# EAGLE design InkTimeSlay (EAGLE 9.7.0)
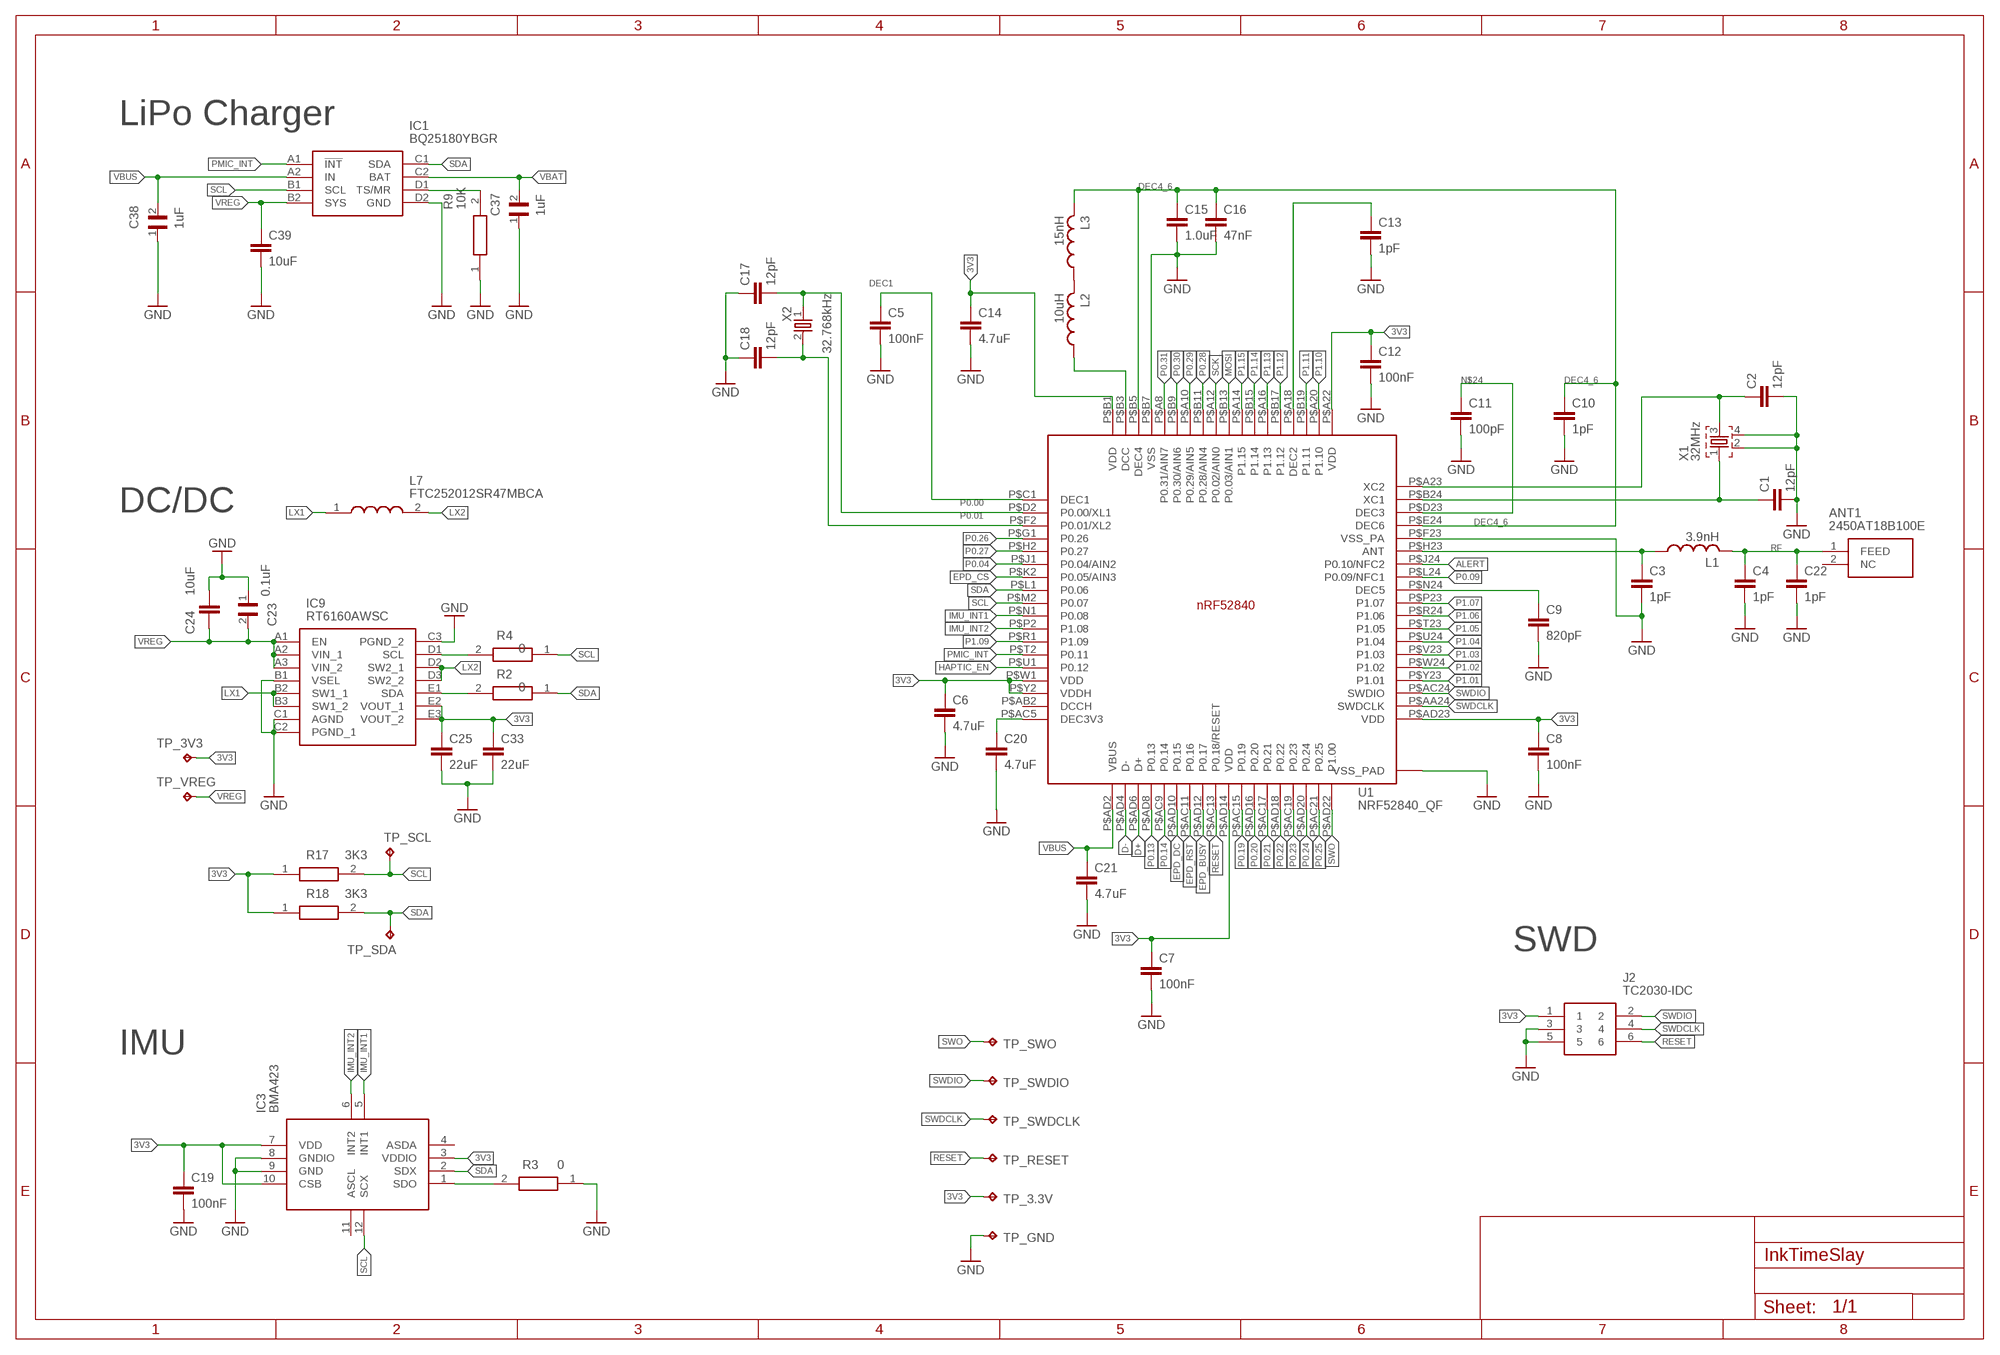
[diagram p0: schematic, sheet 1, part 1 of 2]
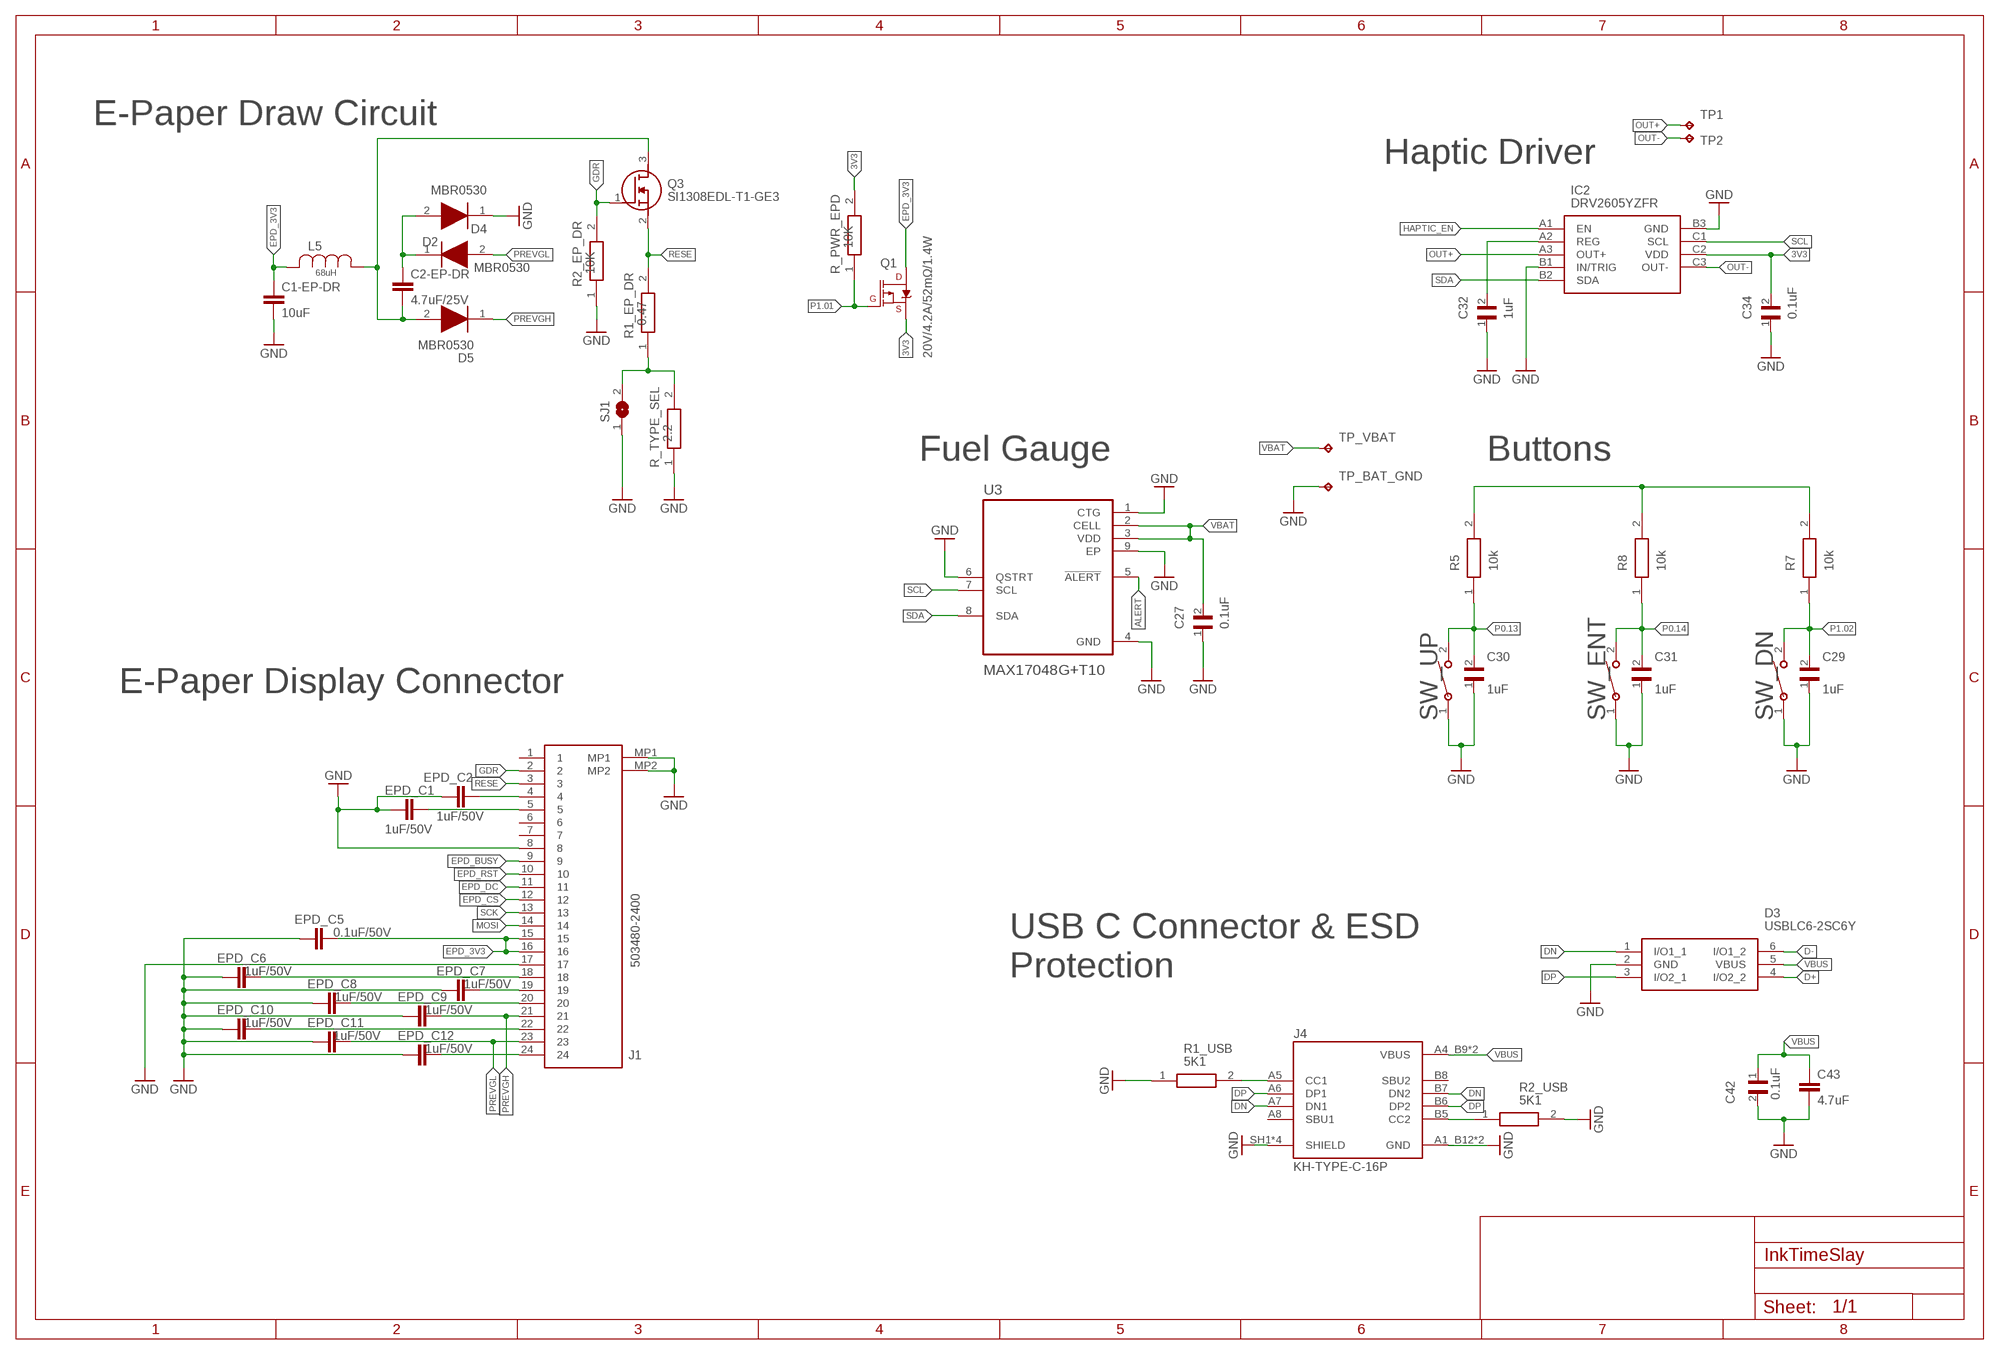
[diagram p1: schematic, sheet 1, part 2 of 2]

## Parts
ANT1  2450AT18B100E  2450AT18B100E_2450AT18B100E  [2450AT18B100E_ANTC3216X140N]
C1  12pF  NORDIC_NRF_3_CAPACITOR_0201_L  [NORDIC_NRF_3_RESC0201_L]
C1-EP-DR  10uF  NORDIC_NRF_3_CAPACITOR_0402_L  [NORDIC_NRF_3_RESC0402_L]
C2  12pF  NORDIC_NRF_3_CAPACITOR_0201_L  [NORDIC_NRF_3_RESC0201_L]
C2-EP-DR  4.7uF/25V  NORDIC_NRF_3_CAPACITOR_0402_L  [NORDIC_NRF_3_RESC0402_L]
C3  1pF  NORDIC_NRF_3_CAPACITOR_0201_L  [NORDIC_NRF_3_RESC0201_L]
C4  1pF  NORDIC_NRF_3_CAPACITOR_0201_L  [NORDIC_NRF_3_RESC0201_L]
C5  100nF  NORDIC_NRF_3_CAPACITOR_0201_L  [NORDIC_NRF_3_RESC0201_L]
C6  4.7uF  NORDIC_NRF_3_CAPACITOR_0402_L  [NORDIC_NRF_3_RESC0402_L]
C7  100nF  NORDIC_NRF_3_CAPACITOR_0201_L  [NORDIC_NRF_3_RESC0201_L]
C8  100nF  NORDIC_NRF_3_CAPACITOR_0201_L  [NORDIC_NRF_3_RESC0201_L]
C9  820pF  NORDIC_NRF_3_CAPACITOR_0201_L  [NORDIC_NRF_3_RESC0201_L]
C10  1pF  NORDIC_NRF_3_CAPACITOR_0201_L  [NORDIC_NRF_3_RESC0201_L]
C11  100pF  NORDIC_NRF_3_CAPACITOR_0201_L  [NORDIC_NRF_3_RESC0201_L]
C12  100nF  NORDIC_NRF_3_CAPACITOR_0201_L  [NORDIC_NRF_3_RESC0201_L]
C13  1pF  NORDIC_NRF_3_CAPACITOR_0201_L  [NORDIC_NRF_3_RESC0201_L]
C14  4.7uF  NORDIC_NRF_3_CAPACITOR_0402_L  [NORDIC_NRF_3_RESC0402_L]
C15  1.0uF  NORDIC_NRF_3_CAPACITOR_0402_L  [NORDIC_NRF_3_RESC0402_L]
C16  47nF  NORDIC_NRF_3_CAPACITOR_0201_L  [NORDIC_NRF_3_RESC0201_L]
C17  12pF  NORDIC_NRF_3_CAPACITOR_0201_L  [NORDIC_NRF_3_RESC0201_L]
C18  12pF  NORDIC_NRF_3_CAPACITOR_0201_L  [NORDIC_NRF_3_RESC0201_L]
C19  100nF  NORDIC_NRF_3_CAPACITOR_0201_L  [NORDIC_NRF_3_RESC0201_L]
C20  4.7uF  NORDIC_NRF_3_CAPACITOR_0402_L  [NORDIC_NRF_3_RESC0402_L]
C21  4.7uF  NORDIC_NRF_3_CAPACITOR_0402_L  [NORDIC_NRF_3_RESC0402_L]
C22  1pF  NORDIC_NRF_3_CAPACITOR_0201_L  [NORDIC_NRF_3_RESC0201_L]
C23  0.1uF  GRM011R60J152KE01L_2_GRM011R60J152KE01L  [GRM011R60J152KE01L_2_CAPC0201X13N]
C24  10uF  NORDIC_NRF_3_CAPACITOR_0402_L  [NORDIC_NRF_3_RESC0402_L]
C25  22uF  NORDIC_NRF_3_CAPACITOR_0402_L  [NORDIC_NRF_3_RESC0402_L]
C27  0.1uF  GRM011R60J152KE01L_2_GRM011R60J152KE01L  [GRM011R60J152KE01L_2_CAPC0201X13N]
C29  1uF  GRM011R60J152KE01L_2_GRM011R60J152KE01L  [GRM011R60J152KE01L_2_CAPC0201X13N]
C30  1uF  GRM011R60J152KE01L_2_GRM011R60J152KE01L  [GRM011R60J152KE01L_2_CAPC0201X13N]
C31  1uF  GRM011R60J152KE01L_2_GRM011R60J152KE01L  [GRM011R60J152KE01L_2_CAPC0201X13N]
C32  1uF  GRM011R60J152KE01L_2_GRM011R60J152KE01L  [GRM011R60J152KE01L_2_CAPC0201X13N]
C33  22uF  NORDIC_NRF_3_CAPACITOR_0402_L  [NORDIC_NRF_3_RESC0402_L]
C34  0.1uF  GRM011R60J152KE01L_2_GRM011R60J152KE01L  [GRM011R60J152KE01L_2_CAPC0201X13N]
C37  1uF  GRM011R60J152KE01L_2_GRM011R60J152KE01L  [GRM011R60J152KE01L_2_CAPC0201X13N]
C38  1uF  GRM011R60J152KE01L_2_GRM011R60J152KE01L  [GRM011R60J152KE01L_2_CAPC0201X13N]
C39  10uF  NORDIC_NRF_3_CAPACITOR_0402_L  [NORDIC_NRF_3_RESC0402_L]
C42  0.1uF  GRM011R60J152KE01L_2_GRM011R60J152KE01L  [GRM011R60J152KE01L_2_CAPC0201X13N]
C43  4.7uF  NORDIC_NRF_3_CAPACITOR_0402_L  [NORDIC_NRF_3_RESC0402_L]
D2  MBR0530  ESP32_C6_LIBRARY_5_MBR0530  [ESP32_C6_LIBRARY_5_SOD3716X135N]
D3  USBLC6-2SC6Y  ESP32_C6_LIBRARY_3_USBLC6-2SC6Y  [ESP32_C6_LIBRARY_3_SOT95P280X145-6N]
D4  MBR0530  ESP32_C6_LIBRARY_5_MBR0530  [ESP32_C6_LIBRARY_5_SOD3716X135N]
D5  MBR0530  ESP32_C6_LIBRARY_5_MBR0530  [ESP32_C6_LIBRARY_5_SOD3716X135N]
EPD_C1  1uF/50V  NORDIC_NRF_3_CAPACITOR_0402_L  [NORDIC_NRF_3_RESC0402_L]
EPD_C2  1uF/50V  NORDIC_NRF_3_CAPACITOR_0402_L  [NORDIC_NRF_3_RESC0402_L]
EPD_C5  0.1uF/50V  NORDIC_NRF_3_CAPACITOR_0201_L  [NORDIC_NRF_3_RESC0201_L]
EPD_C6  1uF/50V  NORDIC_NRF_3_CAPACITOR_0402_L  [NORDIC_NRF_3_RESC0402_L]
EPD_C7  1uF/50V  NORDIC_NRF_3_CAPACITOR_0402_L  [NORDIC_NRF_3_RESC0402_L]
EPD_C8  1uF/50V  NORDIC_NRF_3_CAPACITOR_0402_L  [NORDIC_NRF_3_RESC0402_L]
EPD_C9  1uF/50V  NORDIC_NRF_3_CAPACITOR_0402_L  [NORDIC_NRF_3_RESC0402_L]
EPD_C10  1uF/50V  NORDIC_NRF_3_CAPACITOR_0402_L  [NORDIC_NRF_3_RESC0402_L]
EPD_C11  1uF/50V  NORDIC_NRF_3_CAPACITOR_0402_L  [NORDIC_NRF_3_RESC0402_L]
EPD_C12  1uF/50V  NORDIC_NRF_3_CAPACITOR_0402_L  [NORDIC_NRF_3_RESC0402_L]
IC1  BQ25180YBGR  BQ25180YBGR_BQ25180YBGR  [BQ25180YBGR_BGA8C40P2X4_100X155X50]
IC2  DRV2605YZFR  DRV2605YZFR_DRV2605YZFR  [DRV2605YZFR_BGA9C50P3X3_144X144X62]
IC3  BMA423  BMA423_BMA423  [BMA423_BMA423]
IC9  RT6160AWSC  RT6160AWSC_RT6160AWSC  [RT6160AWSC_BGA15C40P3X5_140X230X60]
J1  503480-2400  503480-2400_503480-2400  [503480-2400_5034802400]
J2  TC2030-IDC  TC2030-IDC_TC2030-IDC  [TC2030-IDC_TC2030IDC]
J4  KH-TYPE-C-16P  KH-TYPE-C-16P_KH-TYPE-C-16P  [KH-TYPE-C-16P_KINGHELM_KH-TYPE-C-16P]
L1  3.9nH  NORDIC_NRF_2_INDUCTOR_0402_L  [NORDIC_NRF_2_RESC0402_L]
L2  10uH  NORDIC_NRF_2_INDUCTOR_0402_L  [NORDIC_NRF_2_RESC0402_L]
L3  15nH  NORDIC_NRF_2_INDUCTOR_0402_L  [NORDIC_NRF_2_RESC0402_L]
L5  68uH  ESP32_C6_LIBRARY_2_744043680IND_4828-WE-TPC_WRE  [ESP32_C6_LIBRARY_2_IND_4828-WE-TPC_WRE]
L7  FTC252012SR47MBCA  MLP2016SR47MT0S1_FTC252012SR47MBCA  [MLP2016SR47MT0S1_INDC2016X100N]
Q1  20V/4.2A/52mΩ/1.4W  ESP32_C6_LIBRARY_4_ESP32_WROVER_SPARKFUN-DISCRETESEMI_MOSFET_PCH-DMG2305UX-7  [ESP32_C6_LIBRARY_4_ESP32_C6_LIBRARY_4_ESP32_C6_LIBRARY_4_ESP32_C6_LIBRARY_4_ESP32_WROVER_SPARKFUN-DISCRETESEMI_SOT23-3]
Q3  SI1308EDL-T1-GE3  ESP32_C6_LIBRARY_6_SI1308EDL-T1-GE3  [ESP32_C6_LIBRARY_6_SOT65P210X110-3N]
R1_EP_DR  0.47  ERA-1AEB3401C_CPF0201D7K68C1  [ERA-1AEB3401C_0201]
R1_USB  5K1  ERA-1AEB3401C_CPF0201D7K68C1  [ERA-1AEB3401C_0201]
R2  0  ERA-1AEB3401C_CPF0201D7K68C1  [ERA-1AEB3401C_0201]
R2_EP_DR  10K  ERA-1AEB3401C_CPF0201D7K68C1  [ERA-1AEB3401C_0201]
R2_USB  5K1  ERA-1AEB3401C_CPF0201D7K68C1  [ERA-1AEB3401C_0201]
R3  0  ERA-1AEB3401C_CPF0201D7K68C1  [ERA-1AEB3401C_0201]
R4  0  ERA-1AEB3401C_CPF0201D7K68C1  [ERA-1AEB3401C_0201]
R5  10k  ERA-1AEB3401C_CPF0201D7K68C1  [ERA-1AEB3401C_0201]
R7  10k  ERA-1AEB3401C_CPF0201D7K68C1  [ERA-1AEB3401C_0201]
R8  10k  ERA-1AEB3401C_CPF0201D7K68C1  [ERA-1AEB3401C_0201]
R9  10K  ERA-1AEB3401C_CPF0201D7K68C1  [ERA-1AEB3401C_0201]
R17  3K3  ERA-1AEB3401C_CPF0201D7K68C1  [ERA-1AEB3401C_0201]
R18  3K3  ERA-1AEB3401C_CPF0201D7K68C1  [ERA-1AEB3401C_0201]
R_PWR_EPD  10K  ERA-1AEB3401C_CPF0201D7K68C1  [ERA-1AEB3401C_0201]
R_TYPE_SEL  2.2  ERA-1AEB3401C_CPF0201D7K68C1  [ERA-1AEB3401C_0201]
SJ1  ESP32_C6_LIBRARY_7_JUMPER_SJ  [ESP32_C6_LIBRARY_7_JUMPER_SJ]
SW_DN  2025-10-22_07-23-44_LIBRARY_EVP-AKE31ASW_EVP-AKE31A_PAN  [2025-10-22_07-23-44_LIBRARY_SW_EVP-AKE31A_PAN]
SW_ENT  2025-10-22_07-23-44_LIBRARY_EVP-AKE31ASW_EVP-AKE31A_PAN  [2025-10-22_07-23-44_LIBRARY_SW_EVP-AKE31A_PAN]
SW_UP  2025-10-22_07-23-44_LIBRARY_EVP-AKE31ASW_EVP-AKE31A_PAN  [2025-10-22_07-23-44_LIBRARY_SW_EVP-AKE31A_PAN]
TP1  HECTOR_WATCH_1_TPTP20R  [HECTOR_WATCH_1_TP20R]
TP2  HECTOR_WATCH_1_TPTP20R  [HECTOR_WATCH_1_TP20R]
TP_3.3V  HECTOR_WATCH_1_TPTP20R  [HECTOR_WATCH_1_TP20R]
TP_3V3  HECTOR_WATCH_1_TPTP20R  [HECTOR_WATCH_1_TP20R]
TP_BAT_GND  HECTOR_WATCH_1_TPTP20R  [HECTOR_WATCH_1_TP20R]
TP_GND  HECTOR_WATCH_1_TPTP20R  [HECTOR_WATCH_1_TP20R]
TP_RESET  HECTOR_WATCH_1_TPTP20R  [HECTOR_WATCH_1_TP20R]
TP_SCL  HECTOR_WATCH_1_TPTP20R  [HECTOR_WATCH_1_TP20R]
TP_SDA  HECTOR_WATCH_1_TPTP20R  [HECTOR_WATCH_1_TP20R]
TP_SWDCLK  HECTOR_WATCH_1_TPTP20R  [HECTOR_WATCH_1_TP20R]
TP_SWDIO  HECTOR_WATCH_1_TPTP20R  [HECTOR_WATCH_1_TP20R]
TP_SWO  HECTOR_WATCH_1_TPTP20R  [HECTOR_WATCH_1_TP20R]
TP_VBAT  HECTOR_WATCH_1_TPTP20R  [HECTOR_WATCH_1_TP20R]
TP_VREG  HECTOR_WATCH_1_TPTP20R  [HECTOR_WATCH_1_TP20R]
U1  NRF52840_QF  NORDIC_NRF_4_NRF52840_QF  [NORDIC_NRF_4_AQFN50P700X700X85_HS-74N]
U3  MAX17048G+T10  ESP32_C6_LIBRARY_MAX17048G+T10  [ESP32_C6_LIBRARY_SON50P200X200X80-9N]
X1  32MHz  NORDIC_NRF_XTAL_32MHZ  [NORDIC_NRF_BT-XTAL_2016_N]
X2  32.768kHz  NORDIC_NRF_1_XTAL_32KHZ  [NORDIC_NRF_1_XTAL_3215_N]

## Nets
3V3: C6.1 C7.1 C8.1 C12.1 C14.1 C19.1 C25.1 C33.1 C34.2 IC2.C2(VDD) IC3.3(VDDIO) IC3.7(VDD) IC3.10(CSB) IC9.E2(VOUT_1) IC9.E3(VOUT_2) J2.1 Q1.2(S) R17.1 R18.1 R_PWR_EPD.2 TP_3.3V.TP TP_3V3.TP U1.P$A22(VDD) U1.P$AD14(VDD) U1.P$AD23(VDD) U1.P$B1(VDD) U1.P$W1(VDD) U1.P$Y2(VDDH)
ALERT: U1.P$J24(P0.10/NFC2) U3.5(!ALERT)
D+: D3.4(I/O2_2) U1.P$AD6(D+)
D-: D3.6(I/O1_2) U1.P$AD4(D-)
DEC1: C5.1 U1.P$C1(DEC1)
DEC4_6: C10.1 C15.1 C16.1 L3.2 U1.P$B5(DEC4) U1.P$E24(DEC6)
DN: D3.1(I/O1_1) J4.A7(DN1) J4.B7(DN2)
DP: D3.3(I/O2_1) J4.A6(DP1) J4.B6(DP2)
EPD_3V3: C1-EP-DR.1 EPD_C5.2 J1.15 J1.16 L5.2 Q1.3(D)
EPD_BUSY: J1.9 U1.P$AD12(P0.17)
EPD_CS: J1.12 U1.P$K2(P0.05/AIN3)
EPD_DC: J1.11 U1.P$AD10(P0.15)
EPD_RST: J1.10 U1.P$AC11(P0.16)
GDR: J1.2 Q3.1(G) R2_EP_DR.2
GND: C1-EP-DR.2 C1.2 C2.2 C3.2 C4.2 C5.2 C6.2 C7.2 C8.2 C9.2 C10.2 C11.2 C12.2 C13.2 C14.2 C15.2 C16.2 C17.1 C18.1 C19.2 C20.2 C21.2 C22.2 C23.1 C24.1 C25.2 C27.1 C29.1 C30.1 C31.1 C32.1 C33.2 C34.1 C37.1 C38.1 C39.2 C42.2 C43.2 D3.2(GND) D4.1(K) EPD_C1.1 EPD_C2.1 EPD_C5.1 EPD_C6.1 EPD_C7.1 EPD_C8.1 EPD_C9.1 EPD_C10.1 EPD_C11.1 EPD_C12.1 IC1.D2(GND) IC2.B1(IN/TRIG) IC2.B3(GND) IC3.8(GNDIO) IC3.9(GND) IC9.B1(VSEL) IC9.C1(AGND) IC9.C2(PGND_1) IC9.C3(PGND_2) J1.8 J1.17 J1.MP1 J1.MP2 J2.3 J2.5 J4.A1_B12(GND) J4.A12_B1(GND) J4.SH1(SHIELD) J4.SH2(SHIELD) J4.SH3(SHIELD) J4.SH4(SHIELD) R1_USB.1 R2_EP_DR.1 R2_USB.2 R3.1 R9.1 R_TYPE_SEL.1 SJ1.1 SW_DN.1 SW_ENT.1 SW_UP.1 TP_BAT_GND.TP TP_GND.TP U1.P$74(VSS_PAD) U1.P$75(VSS_PAD) U1.P$76(VSS_PAD) U1.P$77(VSS_PAD) U1.P$78(VSS_PAD) U1.P$79(VSS_PAD) U1.P$80(VSS_PAD) U1.P$81(VSS_PAD) U1.P$82(VSS_PAD) U1.P$83(VSS_PAD) U1.P$84(VSS_PAD) U1.P$85(VSS_PAD) U1.P$86(VSS_PAD) U1.P$87(VSS_PAD) U1.P$88(VSS_PAD) U1.P$89(VSS_PAD) U1.P$90(VSS_PAD) U1.P$B7(VSS) U1.P$F23(VSS_PA) U3.1(CTG) U3.4(GND) U3.6(QSTRT) U3.9(EP) X1.2 X1.4
HAPTIC_EN: IC2.A1(EN) U1.P$U1(P0.12)
IMU_INT1: IC3.5(INT1) U1.P$N1(P0.08)
IMU_INT2: IC3.6(INT2) U1.P$P2(P1.08)
LX1: IC9.B2(SW1_1) IC9.B3(SW1_2) L7.1
LX2: IC9.D2(SW2_1) IC9.D3(SW2_2) L7.2
MOSI: J1.14 U1.P$B13(P0.03/AIN1)
N$1: C2-EP-DR.2 D5.2(A) L5.1 Q3.3(D)
N$2: L2.2 L3.1
N$3: IC1.D1(TS/MR) R9.2
N$4: C1.1 U1.P$B24(XC1) X1.1
N$5: L2.1 U1.P$B3(DCC)
N$6: C2-EP-DR.1 D2.1(K) D4.2(A)
N$7: R5.2 R7.2 R8.2
N$8: C32.2 IC2.A2(REG)
N$9: R1_EP_DR.1 R_TYPE_SEL.2 SJ1.2
N$10: J4.A5(CC1) R1_USB.2
N$11: EPD_C2.2 J1.4
N$12: EPD_C1.2 J1.5
N$14: C9.1 U1.P$N24(DEC5)
N$15: C13.1 U1.P$A18(DEC2)
N$17: C20.1 U1.P$AC5(DEC3V3)
N$18: IC9.D1(SCL) R4.2
N$19: J4.B5(CC2) R2_USB.1
N$20: C3.1 L1.1 U1.P$H23(ANT)
N$21: IC9.E1(SDA) R2.2
N$24: C11.1 U1.P$D23(DEC3)
N$25: IC3.1(SDO) R3.2
N$26: EPD_C6.2 J1.18
N$27: EPD_C7.2 J1.19
N$28: C2.1 U1.P$A23(XC2) X1.3
N$29: EPD_C8.2 J1.20
N$31: EPD_C10.2 J1.22
N$33: EPD_C12.2 J1.24
OUT+: IC2.A3(OUT+) TP1.TP
OUT-: IC2.C3(OUT-) TP2.TP
P0.00: C17.2 U1.P$D2(P0.00/XL1) X2.1
P0.01: C18.2 U1.P$F2(P0.01/XL2) X2.2
P0.04: U1.P$J1(P0.04/AIN2)
P0.09: U1.P$L24(P0.09/NFC1)
P0.13: C30.2 R5.1 SW_UP.2 U1.P$AD8(P0.13)
P0.14: C31.2 R8.1 SW_ENT.2 U1.P$AC9(P0.14)
P0.19: U1.P$AC15(P0.19)
P0.20: U1.P$AD16(P0.20)
P0.21: U1.P$AC17(P0.21)
P0.22: U1.P$AD18(P0.22)
P0.23: U1.P$AC19(P0.23)
P0.24: U1.P$AD20(P0.24)
P0.25: U1.P$AC21(P0.25)
P0.26: U1.P$G1(P0.26)
P0.27: U1.P$H2(P0.27)
P0.28: U1.P$B11(P0.28/AIN4)
P0.29: U1.P$A10(P0.29/AIN5)
P0.30: U1.P$B9(P0.30/AIN6)
P0.31: U1.P$A8(P0.31/AIN7)
P1.01: Q1.1(G) R_PWR_EPD.1 U1.P$Y23(P1.01)
P1.02: C29.2 R7.1 SW_DN.2 U1.P$W24(P1.02)
P1.03: U1.P$V23(P1.03)
P1.04: U1.P$U24(P1.04)
P1.05: U1.P$T23(P1.05)
P1.06: U1.P$R24(P1.06)
P1.07: U1.P$P23(P1.07)
P1.09: U1.P$R1(P1.09)
P1.10: U1.P$A20(P1.10)
P1.11: U1.P$B19(P1.11)
P1.12: U1.P$B17(P1.12)
P1.13: U1.P$A16(P1.13)
P1.14: U1.P$B15(P1.14)
P1.15: U1.P$A14(P1.15)
PMIC_INT: IC1.A1(!INT) U1.P$T2(P0.11)
PREVGH: D5.1(K) EPD_C9.2 J1.21
PREVGL: D2.2(A) EPD_C11.2 J1.23
RESE: J1.3 Q3.2(S) R1_EP_DR.2
RESET: J2.6 TP_RESET.TP U1.P$AC13(P0.18/RESET)
RF: ANT1.1(FEED) C4.1 C22.1 L1.2
SCK: J1.13 U1.P$A12(P0.02/AIN0)
SCL: IC1.B1(SCL) IC2.C1(SCL) IC3.12(SCX) R4.1 R17.2 TP_SCL.TP U1.P$M2(P0.07) U3.7(SCL)
SDA: IC1.C1(SDA) IC2.B2(SDA) IC3.2(SDX) R2.1 R18.2 TP_SDA.TP U1.P$L1(P0.06) U3.8(SDA)
SWDCLK: J2.4 TP_SWDCLK.TP U1.P$AA24(SWDCLK)
SWDIO: J2.2 TP_SWDIO.TP U1.P$AC24(SWDIO)
SWO: TP_SWO.TP U1.P$AD22(P1.00)
VBAT: C27.2 C37.2 IC1.C2(BAT) TP_VBAT.TP U3.2(CELL) U3.3(VDD)
VBUS: C21.1 C38.2 C42.1 C43.1 D3.5(VBUS) IC1.A2(IN) J4.A4_B9(VBUS) J4.A9_B4(VBUS) U1.P$AD2(VBUS)
VREG: C23.2 C24.2 C39.1 IC1.B2(SYS) IC9.A1(EN) IC9.A2(VIN_1) IC9.A3(VIN_2) TP_VREG.TP
Unconnected: ANT1.2(NC) IC3.4(ASDA) IC3.11(ASCL) J1.1 J1.6 J1.7 J4.A8(SBU1) J4.B8(SBU2) U1.P$AB2(DCCH)

## Notes on the sheet
- LiPo Charger
- DC/DC
- SWD
- IMU
- E-Paper Draw Circuit
- Haptic Driver
- Fuel Gauge | Buttons
- E-Paper Display Connector
- USB C Connector & ESD
  Protection

## Library data of the parts
ANT1 = InkTime_v5:2450AT18B100E_2450AT18B100E: Antennas 2.45GHz ANTENNA Source: Datasheet <https://www.johansontechnology.com/datasheets/2450AT18B100/2450AT18B100.pdf>; ARROW_PART_NUMBER: 2450AT18B100E; ARROW_PRICE-STOCK: https://www.arrow.com/en/products/2450at18b100e/johanson-dielectrics?utm_currency=USD&region=nac; DESCRIPTION: Antennas 2.45GHz ANTENNA; HEIGHT: 1.4mm; MANUFACTURER_NAME: JOHANSON TECHNOLOGY; MANUFACTURER_PART_NUMBER: 2450AT18B100E; MOUSER_PART_NUMBER: 609-2450AT18B100E; MOUSER_PRICE-STOCK: https://www.mouser.co.uk/ProductDetail/Johanson-Technology/2450AT18B100E?qs=yCnrNFeXz%252Bh5MFsFIXGZGA%3D%3D
C1 C1-EP-DR C2 C2-EP-DR C3-C22 C24 C25 C33 C39 C43 EPD_C1 EPD_C2 EPD_C5-EPD_C12 = InkTime_v5:NORDIC_NRF_3_CAPACITOR: Generic chip capacitor
C23 C27 C29-C32 C34 C37 C38 C42 = InkTime_v5:GRM011R60J152KE01L_2_GRM011R60J152KE01L: Check availability <https://pricing.snapeda.com/parts/GRM011R60J152KE01L/Murata/view-part?ref=eda>; AVAILABILITY: In Stock; CHECK_PRICES: https://www.snapeda.com/parts/GRM011R60J152KE01L/Murata/view-part/?ref=eda; DESCRIPTION: SMD Capacitor X5R(EIA) with Capacitance: 1500pF Tol. 10%. Rated Voltage: 6.3Vdc; MF: Murata; MP: GRM011R60J152KE01L; PACKAGE: 0201 Murata; PRICE: None; SNAPEDA_LINK: https://www.snapeda.com/parts/GRM011R60J152KE01L/Murata/view-part/?ref=snap
D2 D4 D5 = InkTime_v5:ESP32_C6_LIBRARY_5_MBR0530: ON SEMICONDUCTOR - MBR0530 - DIODE, SCHOTTKY, 0.5A, 30V, SOD-123 Source: Datasheet <http://www.onsemi.com/pub/Collateral/MBR0530T1-D.PDF> Check availability <https://pricing.snapeda.com/parts/MBR0530/ON%20Semiconductor/view-part?ref=eda>; AVAILABILITY: In Stock; CHECK_PRICES: https://www.snapeda.com/parts/MBR0530/Onsemi/view-part/?ref=eda; DESCRIPTION: Diode Schottky 30 V 500mA Surface Mount SOD-123; MF: ON Semiconductor; MP: MBR0530; PACKAGE: SOD-123-2 ON Semiconductor; PRICE: None; PURCHASE-URL: https://www.snapeda.com/api/url_track_click_mouser/?unipart_id=179458&manufacturer=ON Semiconductor&part_name=MBR0530&search_term=None; SNAPEDA_LINK: https://www.snapeda.com/parts/MBR0530/Onsemi/view-part/?ref=snap
D3 = InkTime_v5:ESP32_C6_LIBRARY_3_USBLC6-2SC6Y: Low Cap. ESD Protection Auto SOT-23-6 STMicroelectronics USBLC6-2SC6Y, Dual Uni-Directional TVS Diode Array, 6-Pin SOT-23 Source: Datasheet <https://componentsearchengine.com/Datasheets/1/USBLC6-2SC6Y.pdf> Check availability <https://pricing.snapeda.com/parts/USBLC6-2SC6Y/STMicroelectronics/view-part?ref=eda>; AVAILABILITY: In Stock; CHECK_PRICES: https://www.snapeda.com/parts/USBLC6-2SC6Y/STMicroelectronics/view-part/?ref=eda; DESCRIPTION: 17V Clamp 5A (8/20µs) Ipp Tvs Diode Surface Mount SOT-23-6; MF: STMicroelectronics; MP: USBLC6-2SC6Y; PACKAGE: SOT-23-6 STMicroelectronics; PRICE: None; SNAPEDA_LINK: https://www.snapeda.com/parts/USBLC6-2SC6Y/STMicroelectronics/view-part/?ref=snap
IC1 = InkTime_v5:BQ25180YBGR_BQ25180YBGR: Charger IC Lithium Ion/Polymer, Lithium Iron Phosphate 8-DSBGA (1.6x1.1) Source: Datasheet <https://www.ti.com/lit/ds/symlink/bq25180.pdf?ts=1650264094470&ref_url=https%3A%2F%2Fwww.ti.com%2Fproduct%2FBQ25180>; ARROW_PART_NUMBER: BQ25180YBGR; ARROW_PRICE-STOCK: https://www.arrow.com/en/products/bq25180ybgr/texas-instruments?utm_currency=USD&region=nac; DESCRIPTION: Charger IC Lithium Ion/Polymer, Lithium Iron Phosphate 8-DSBGA (1.6x1.1); HEIGHT: 0.5mm; MANUFACTURER_NAME: Texas Instruments; MANUFACTURER_PART_NUMBER: BQ25180YBGR; MOUSER_PART_NUMBER: 595-BQ25180YBGR; MOUSER_PRICE-STOCK: https://www.mouser.co.uk/ProductDetail/Texas-Instruments/BQ25180YBGR?qs=doiCPypUmgEWjAK%252BJAX6Tw%3D%3D
IC2 = InkTime_v5:DRV2605YZFR_DRV2605YZFR: Haptic Driver for ERM/LRA with Built-In Library and Smart Loop Architecture Source: Datasheet <http://www.ti.com/lit/gpn/drv2605>; ARROW_PART_NUMBER: DRV2605YZFR; ARROW_PRICE-STOCK: https://www.arrow.com/en/products/drv2605yzfr/texas-instruments?region=nac; DESCRIPTION: Haptic Driver for ERM/LRA with Built-In Library and Smart Loop Architecture; HEIGHT: 0.625mm; MANUFACTURER_NAME: Texas Instruments; MANUFACTURER_PART_NUMBER: DRV2605YZFR
IC3 = InkTime_v5:BMA423_BMA423: Accelerometers Triaxial low-g 12bit Acceleration Sensor Source: Datasheet <https://www.mouser.com/datasheet/2/783/BST-BMA423-DS000-1509600.pdf>; ARROW_PART_NUMBER: BMA423; ARROW_PRICE-STOCK: https://www.arrow.com/en/products/bma423/bosch; DESCRIPTION: Accelerometers Triaxial low-g 12bit Acceleration Sensor; HEIGHT: 1mm; MANUFACTURER_NAME: BOSCH; MANUFACTURER_PART_NUMBER: BMA423; MOUSER_PART_NUMBER: 262-BMA423; MOUSER_PRICE-STOCK: https://www.mouser.co.uk/ProductDetail/Bosch-Sensortec/BMA423?qs=HXFqYaX1Q2xC%252BSgeGoX3mg%3D%3D
IC9 = InkTime_v5:RT6160AWSC_RT6160AWSC: Buck-Boost Regulator Positive Output Step-Up/Step-Down I2C DC-DC Controller IC 15-WL-CSP (BSC) (1.4x2.3) Source: Datasheet <https://www.richtek.com/SaveDownload.aspx?specid=RT6160A>; DESCRIPTION: Buck-Boost Regulator Positive Output Step-Up/Step-Down I2C DC-DC Controller IC 15-WL-CSP (BSC) (1.4x2.3); HEIGHT: 0.6mm; MANUFACTURER_NAME: RICHTEK; MANUFACTURER_PART_NUMBER: RT6160AWSC; MOUSER_PART_NUMBER: 835-RT6160AWSC; MOUSER_PRICE-STOCK: https://www.mouser.co.uk/ProductDetail/Richtek/RT6160AWSC?qs=amGC7iS6iy%2FLd9PSoixZXQ%3D%3D
J1 = InkTime_v5:503480-2400_503480-2400: FFC & FPC Connectors 0.5mm FPC RA SMT Dual Contact 24Ckt Source: Datasheet <https://componentsearchengine.com/Datasheets/1/503480-2400.pdf>; DESCRIPTION: FFC & FPC Connectors 0.5mm FPC RA SMT Dual Contact 24Ckt; HEIGHT: 1.87mm; MANUFACTURER_NAME: Molex; MANUFACTURER_PART_NUMBER: 503480-2400; MOUSER_PART_NUMBER: 538-503480-2400; MOUSER_PRICE-STOCK: https://www.mouser.co.uk/ProductDetail/Molex/503480-2400?qs=OAhjpuo3Vu7efIoxFh9AOw%3D%3D
J2 = InkTime_v5:TC2030-IDC_TC2030-IDC: CABLE ADAPTER 6 POS Source: Datasheet <https://datasheet.datasheetarchive.com/originals/distributors/Datasheets_SAMA/62bc384e093448baaaa63dbd0b9d8707.pdf>; DESCRIPTION: CABLE ADAPTER 6 POS; HEIGHT: 19mm; MANUFACTURER_NAME: Tag Connect; MANUFACTURER_PART_NUMBER: TC2030-IDC
J4 = InkTime_v5:KH-TYPE-C-16P_KH-TYPE-C-16P: Check availability <https://pricing.snapeda.com/parts/KH-TYPE-C-16P/kinghelm/view-part?ref=eda>; AVAILABILITY: Not in stock; CHECK_PRICES: https://www.snapeda.com/parts/KH-TYPE-C-16P/Kinghelm/view-part/?ref=eda; MF: kinghelm; MP: KH-TYPE-C-16P; PACKAGE: None; PRICE: None; SNAPEDA_LINK: https://www.snapeda.com/parts/KH-TYPE-C-16P/Kinghelm/view-part/?ref=snap
L1-L3 = InkTime_v5:NORDIC_NRF_2_INDUCTOR: Generic chip inductor
L5 = InkTime_v5:ESP32_C6_LIBRARY_2_744043680; COPYRIGHT: Copyright (C) 2024 Ultra Librarian. All rights reserved.; MANUFACTURER_PART_NUMBER: 744043680; MFR_NAME: Wurth Electronics
L7 = InkTime_v5:MLP2016SR47MT0S1_FTC252012SR47MBCA: SMD / SMT Inductors (Coils), L=0.47?H, L x W x T : Source: Datasheet <https://product.tdk.com/system/files/dam/doc/product/inductor/inductor/smd/catalog/inductor_commercial_power_mlp2016_en.pdf>; DESCRIPTION: SMD / SMT Inductors (Coils), L=0.47?H, L x W x T :; HEIGHT: 1mm; JLCPCB: https://jlcpcb.com/partdetail/6763488-FTC252012SR47MBCA/C5832368; MANUFACTURER_NAME: TDK; MANUFACTURER_PART_NUMBER: FTC252012SR47MBCA
Q1 = InkTime_v5:ESP32_C6_LIBRARY_4_ESP32_WROVER_SPARKFUN-DISCRETESEMI_MOSFET_PCH: P-channel MOSFETs Voltage controlled devices that allow control of high current outputs. SparkFun Products: SparkFun ESP32 Thing <https://www.sparkfun.com/products/13907> SparkFun ESP8266 Thing <https://www.sparkfun.com/products/13231> SparkFun Pi Servo HAT V2 <https://www.sparkfun.com/products/15316> DMG2305UX-7 (20V/4.2A/SOT23-3); PROD_ID: TRAN-14388
Q3 = InkTime_v5:ESP32_C6_LIBRARY_6_SI1308EDL-T1-GE3: MOSFET N-Ch 30V 1.5A TrenchFET SC70 Vishay Si1308EDL-T1-GE3 N-channel MOSFET Transistor, 1.5 A, 30 V, 3-Pin SC-70 Source: Datasheet <https://componentsearchengine.com/Datasheets/1/SI1308EDL-T1-GE3.pdf> Check availability <https://pricing.snapeda.com/parts/SI1308EDL-T1-GE3/Vishay%20Siliconix/view-part?ref=eda>; AVAILABILITY: In Stock; CHECK_PRICES: https://www.snapeda.com/parts/SI1308EDL-T1-GE3/Vishay+Siliconix/view-part/?ref=eda; DESCRIPTION: Si1308EDL-T1-GE3 N-channel MOSFET Transistor, 1.5 A, 30 V, 3-Pin SC-70 | Siliconix / Vishay SI1308EDL-T1-GE3; MF: Vishay Siliconix; MP: SI1308EDL-T1-GE3; PACKAGE: SOT-323 Vishay Semiconductor; PRICE: None; PURCHASE-URL: https://www.snapeda.com/api/url_track_click_mouser/?unipart_id=274603&manufacturer=Vishay Siliconix&part_name=SI1308EDL-T1-GE3&search_term=None; SNAPEDA_LINK: https://www.snapeda.com/parts/SI1308EDL-T1-GE3/Vishay+Siliconix/view-part/?ref=snap
R1_EP_DR R1_USB R2 R2_EP_DR R2_USB R3-R5 R7-R9 R17 R18 R_PWR_EPD R_TYPE_SEL = InkTime_v5:ERA-1AEB3401C_CPF0201D7K68C1: 7.68k 0201 Thin Film Surface Mount Fixed Resistor +/-0.5% 0.031W CPF0201D7K68C1 Source: Datasheet <http://www.te.com/commerce/DocumentDelivery/DDEController?Action=showdoc&DocId=Data Sheet1773200-1ApdfEnglishENG_DS_1773200-1_A.pdf4-2176215-6>
SJ1 = InkTime_v5:ESP32_C6_LIBRARY_7_JUMPER_SJ: SMD solder JUMPER
SW_DN SW_ENT SW_UP = InkTime_v5:2025-10-22_07-23-44_LIBRARY_EVP-AKE31A; COPYRIGHT: Copyright (C) 2025 Ultra Librarian. All rights reserved.; DIGI-KEY_PART_NUMBER_1: P123437TR-ND; DIGI-KEY_PART_NUMBER_2: P123437CT-ND; DIGI-KEY_PART_NUMBER_3: P123437DKR-ND; MANUFACTURER_NAME: Panasonic; MANUFACTURER_PART_NUMBER: EVP-AKE31A
TP1 TP2 TP_3.3V TP_3V3 TP_BAT_GND TP_GND TP_RESET TP_SCL TP_SDA TP_SWDCLK TP_SWDIO TP_SWO TP_VBAT TP_VREG = InkTime_v5:HECTOR_WATCH_1_TP: Test pad
U1 = InkTime_v5:NORDIC_NRF_4_NRF52840_QF: nRF52840 Features Advanced Single chip 2.4 GHz multi-protocol SoC 32-bit ARM Cortex-M4F Processor 1.7v to 5.5v operation 1MB flash + 256kB RAM Bluetooth 5 support for long range and high throughput 802.15.4 radio support On-chip NFC PPI –Programmable Peripheral Interconnect Automated power management system with automatic power management of each peripheral Configurable I/O mapping for analog and digital I/O 48 x GPIO 1 x QSPI 4 x Master/Slave SPI 2 x Two-wire interface (I²C) I²S interface 2 x UART 4 x PWM USB 2.0 controller ARM TrustZone CryptoCell-310 Cryptographic and security module AES 128-bit ECB/CCM/AAR hardware accelerator Digital microphone interface (PDM) Quadrature decoder 12-bit ADC Low power comparator On-chip 50Ω balun On-air compatible with nRF52, nRF51 and nRF24 Series Applications Advanced high performance wearables Wearables for secure payments Virtual Reality/Augmented Reality systems Smart Home sensor networks Smart city sensor networks High performance HID controllers Internet of Things (IoT) sensor networks Smart door locks Smart lighting networks Connected white goods
U3 = InkTime_v5:ESP32_C6_LIBRARY_MAX17048G+T10: Check availability <https://pricing.snapeda.com/parts/MAX17048G%2BT10/Analog%20Devices/view-part?ref=eda>; AVAILABILITY: In Stock; CHECK_PRICES: https://www.snapeda.com/parts/MAX17048G+T10/Analog+Devices/view-part/?ref=eda; DESCRIPTION: 3µA 1-Cell/2-Cell Fuel Gauge with ModelGauge; MF: Analog Devices; MP: MAX17048G+T10; PACKAGE: TDFN-8 Maxim; PRICE: None; PURCHASE-URL: https://www.snapeda.com/api/url_track_click_mouser/?unipart_id=329239&manufacturer=Analog Devices&part_name=MAX17048G+T10&search_term=None; SNAPEDA_LINK: https://www.snapeda.com/parts/MAX17048G+T10/Analog+Devices/view-part/?ref=snap
X1 = InkTime_v5:NORDIC_NRF_XTAL_32MHZ
X2 = InkTime_v5:NORDIC_NRF_1_XTAL_32KHZ

## Board
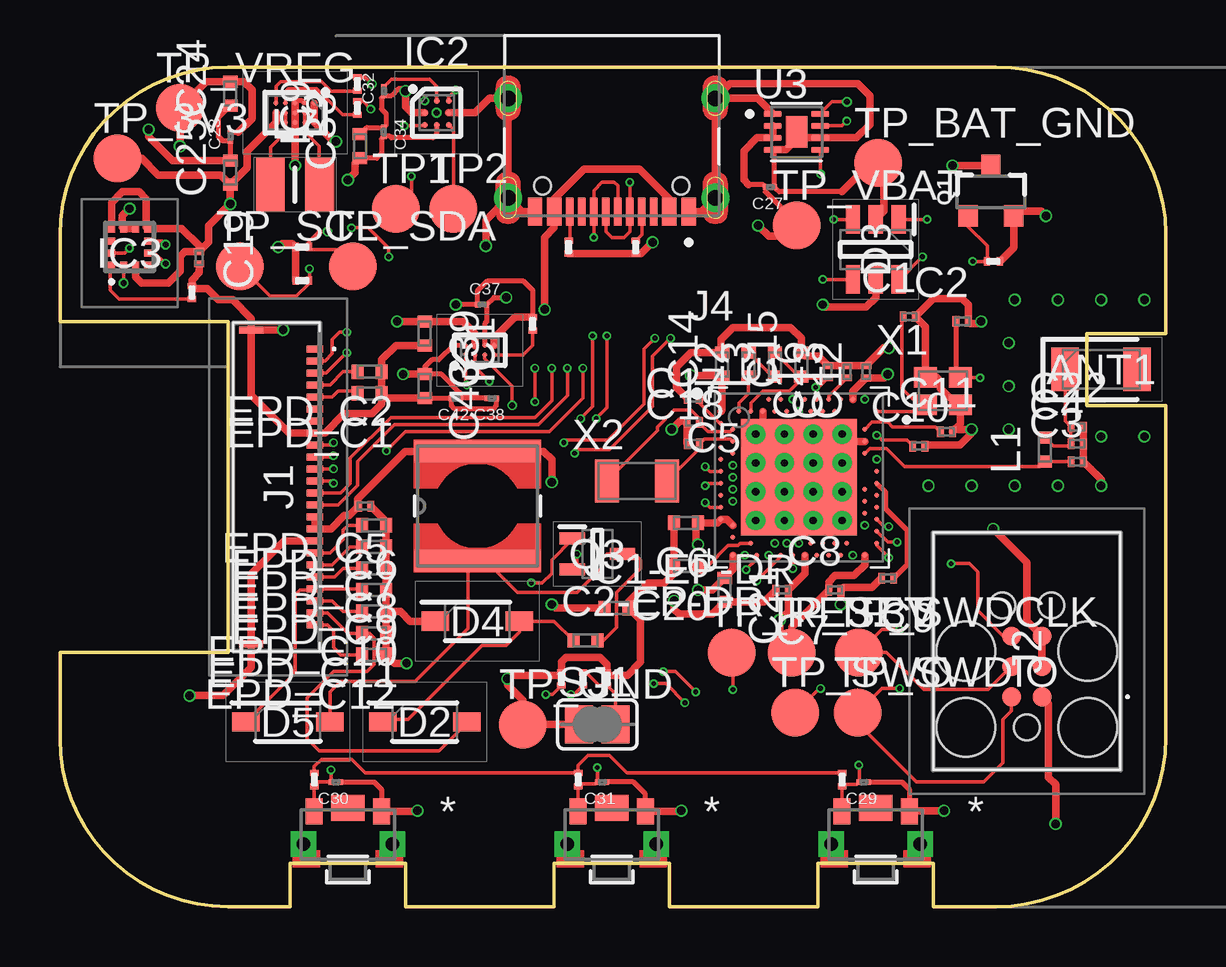
[diagram p2: board, top side]
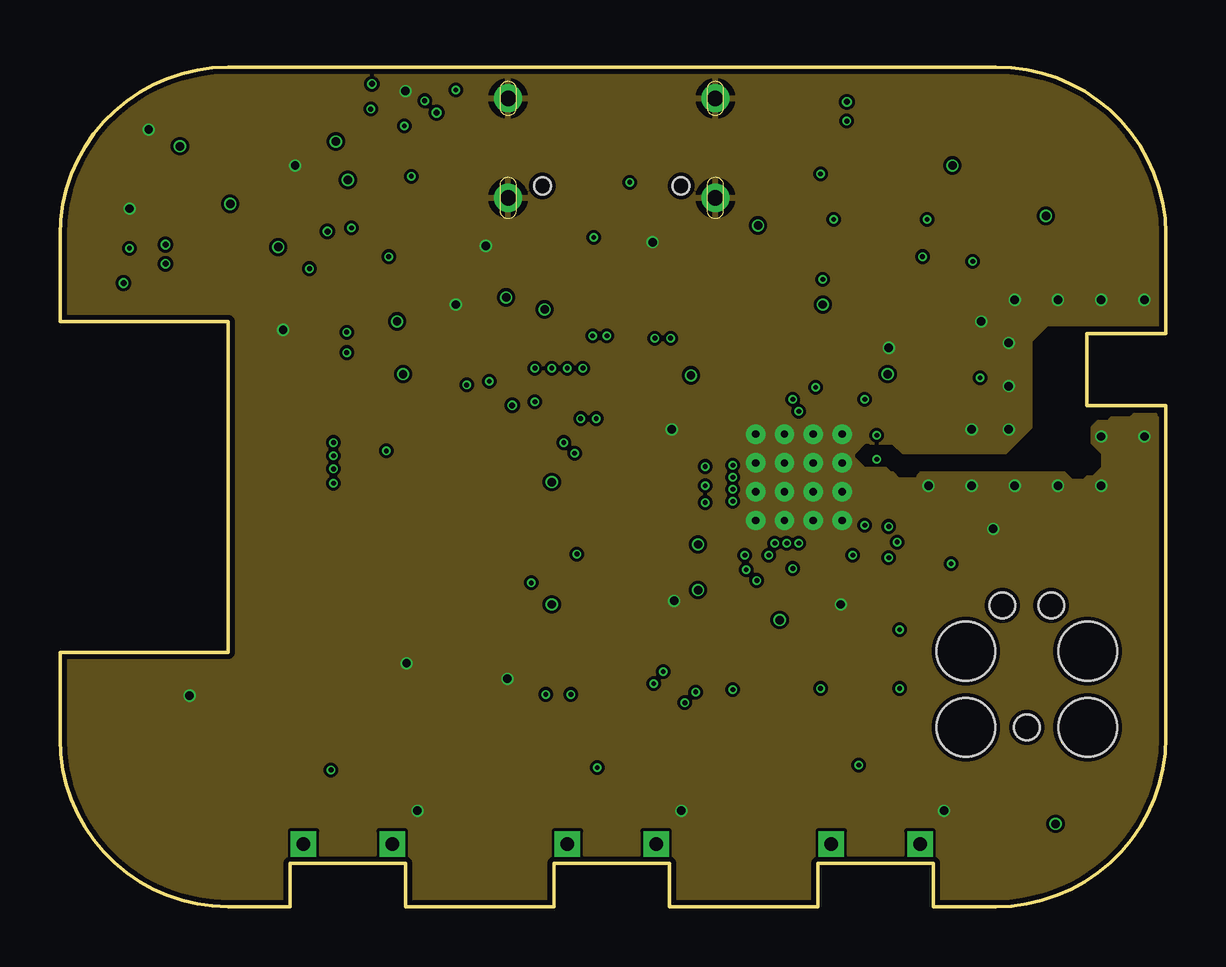
[diagram p3: board, inner layer Route2]
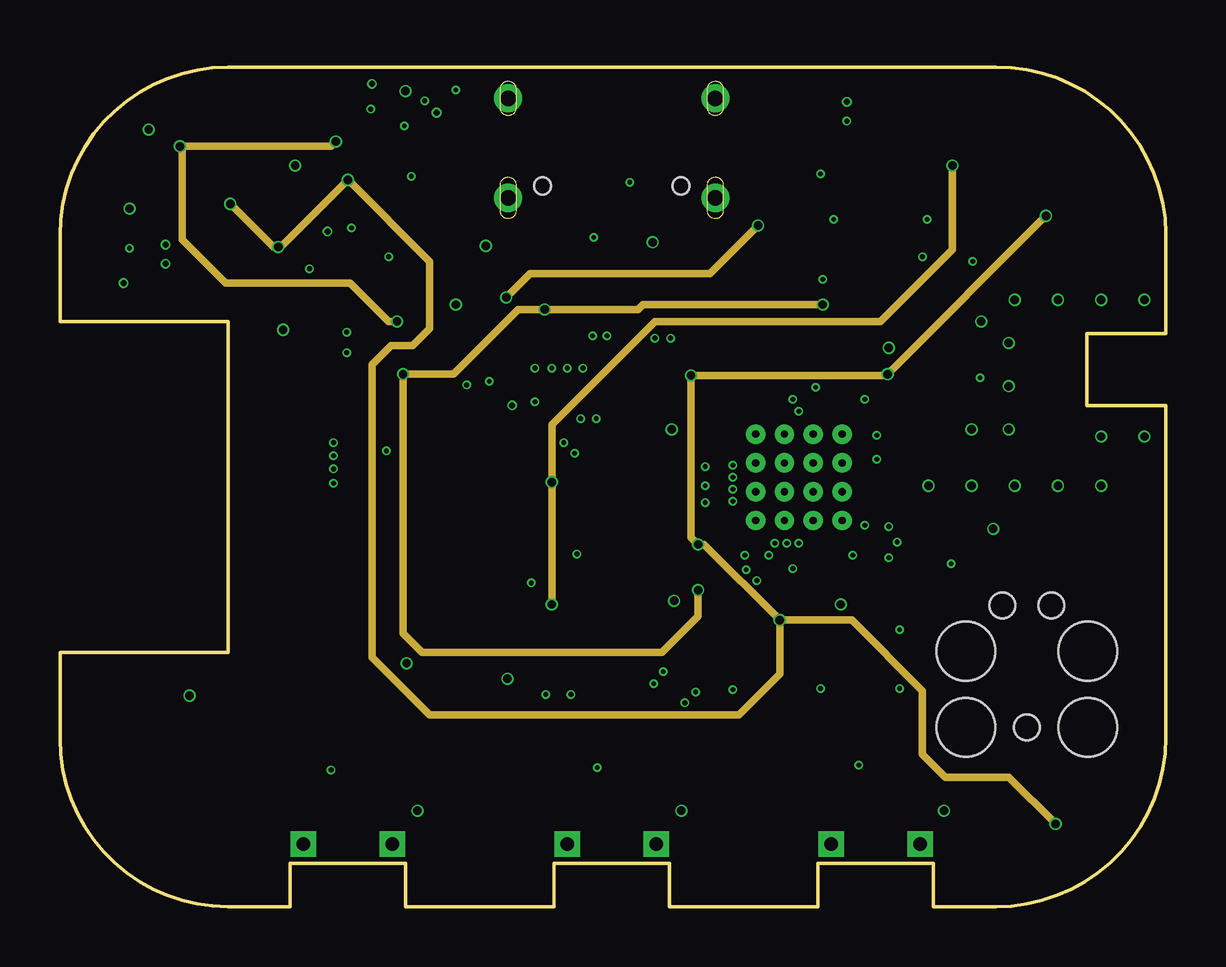
[diagram p4: board, inner layer Route15]
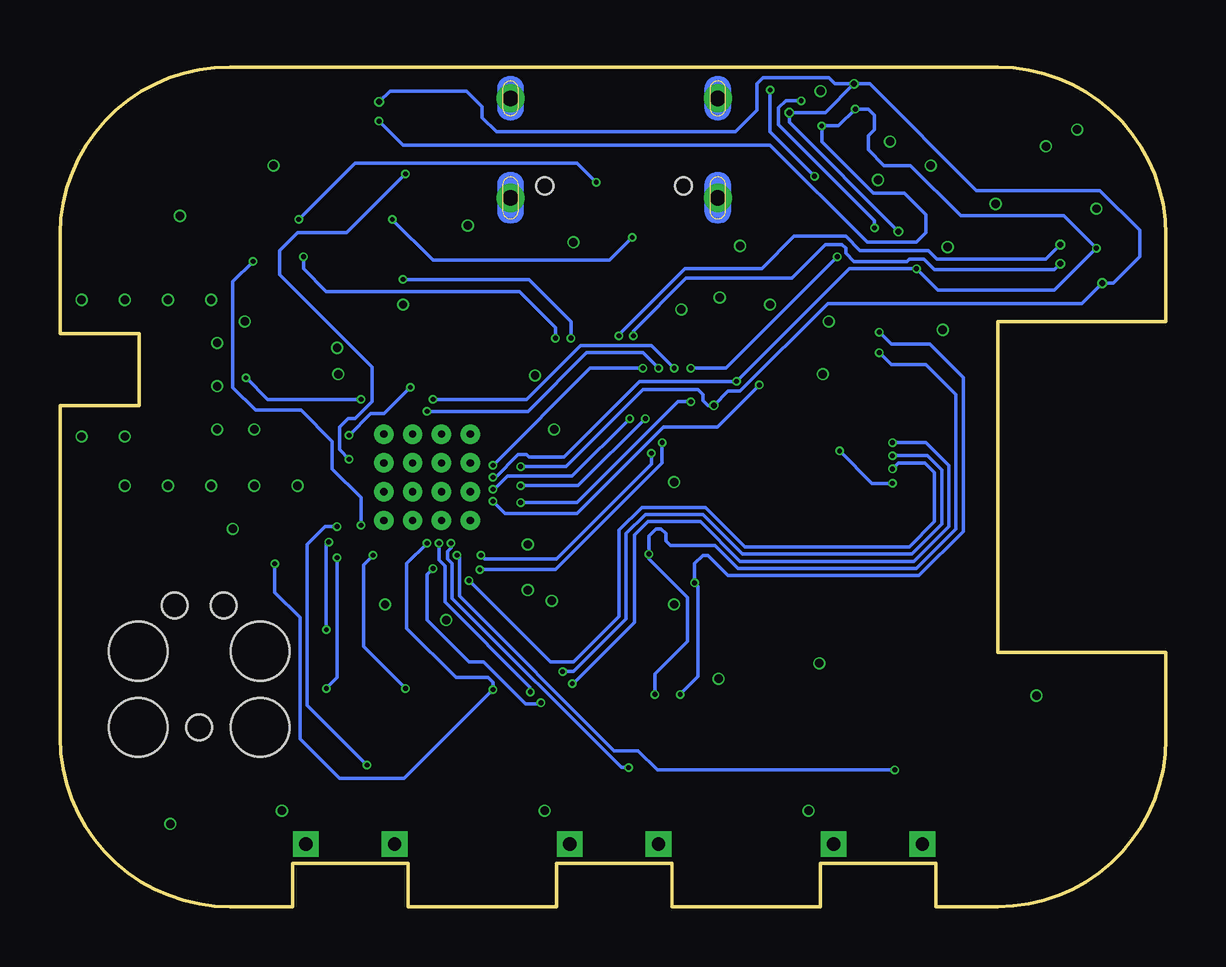
[diagram p5: board, bottom side, seen from below]

Size 46.1 x 35 mm. Coordinates in mm from the lower left corner, seen from the top.
Outline: 39,0 36.4,0 36.4,1.8 31.6,1.8 31.6,0 25.4,0 25.4,1.8 20.6,1.8 20.6,0 14.4,0 14.4,1.8 9.6,1.8 9.6,0 7,0 arc-90 0,7 0,10.6 7,10.6 7,24.4 0,24.4 0,28 arc-90 7,35 39,35 arc-90 46.1,28.05 46.1,23.9 42.8,23.9 42.8,20.9 46.1,20.9 46.1,7.05 arc-90 39,0
Copper layers (1+2*15+16): Top 0.035mm / dielectric 1.6mm / Route2 0.035mm / dielectric 0.15mm / Route15 0.035mm / dielectric 0.2mm / Bottom 0.035mm
Design rules "jlcpcb-2layers.dru *": minimum track width 5mil, minimum drill 0.2mm, track to track 5mil, track to pad 5mil, pad to pad 5mil, via to via 5mil, smd to smd 5mil, copper to edge 0.2mm, drill to drill 6mil, minimum pad ring 10mil, minimum via ring 3mil, stop-mask expansion 4mil, vias tented up to drill 999mm, thermal gap 10mil

### Footprints (pad centres in the part's own frame; a part is rotated, then mirrored left to right if it is on the bottom)
2450AT18B100E_ANTC3216X140N = smd 1.15 x 1.8: 1 -1.5,0; 2 1.5,0
NORDIC_NRF_3_RESC0201_L = smd 0.28 x 0.43: 1 -0.255,0; 2 0.255,0
NORDIC_NRF_3_RESC0402_L = smd 0.5 x 0.6: 1 -0.5,0; 2 0.5,0
GRM011R60J152KE01L_2_CAPC0201X13N = smd 0.22 x 0.23: 1 -0.185,0; 2 0.185,0
ESP32_C6_LIBRARY_5_SOD3716X135N = smd 1.15 x 0.8: 1 -1.75,0; 2 1.75,0
ESP32_C6_LIBRARY_3_SOT95P280X145-6N = smd 1.2 x 0.6: 1 -1.25,0.95; 2 -1.25,0; 3 -1.25,-0.95; 4 1.25,-0.95; 5 1.25,0; 6 1.25,0.95
BQ25180YBGR_BGA8C40P2X4_100X155X50 = smd 0.2 x 0.2: A1 -0.2,0.6; A2 0.2,0.6; B1 -0.2,0.2; B2 0.2,0.2; C1 -0.2,-0.2; C2 0.2,-0.2; D1 -0.2,-0.6; D2 0.2,-0.6
DRV2605YZFR_BGA9C50P3X3_144X144X62 = smd 0.25 x 0.25: A1 -0.5,0.5; A2 0,0.5; A3 0.5,0.5; B1 -0.5,0; B2 0,0; B3 0.5,0; C1 -0.5,-0.5; C2 0,-0.5; C3 0.5,-0.5
BMA423_BMA423 = smd 0.3 x 0.35: 1 -0.75,-0.775; 2 -0.25,-0.775; 3 0.25,-0.775; 4 0.75,-0.775; 7 0.75,0.775; 8 0.25,0.775; 9 -0.25,0.775; 10 -0.75,0.775 | smd 0.35 x 0.3: 5 0.775,-0.25; 6 0.775,0.25; 11 -0.775,0.25; 12 -0.775,-0.25
RT6160AWSC_BGA15C40P3X5_140X230X60 = smd 0.216 x 0.216: A1 -0.4,0.8; A2 0,0.8; A3 0.4,0.8; B1 -0.4,0.4; B2 0,0.4; B3 0.4,0.4; C1 -0.4,0; C2 0,0; C3 0.4,0; D1 -0.4,-0.4; D2 0,-0.4; D3 0.4,-0.4; E1 -0.4,-0.8; E2 0,-0.8; E3 0.4,-0.8
503480-2400_5034802400 = smd 0.3 x 0.7: 1 -5.75,1.525; 2 -5.25,1.525; 3 -4.75,1.525; 4 -4.25,1.525; 5 -3.75,1.525; 6 -3.25,1.525; 7 -2.75,1.525; 8 -2.25,1.525; 9 -1.75,1.525; 10 -1.25,1.525; 11 -0.75,1.525; 12 -0.25,1.525; 13 0.25,1.525; 14 0.75,1.525; 15 1.25,1.525; 16 1.75,1.525; 17 2.25,1.525; 18 2.75,1.525; 19 3.25,1.525; 20 3.75,1.525; 21 4.25,1.525; 22 4.75,1.525; 23 5.25,1.525; 24 5.75,1.525 | smd 0.3 x 1: MP1 -6.54,-1.125; MP2 6.54,-1.125
TC2030-IDC_TC2030IDC = smd 0.783 x 0.783: 1 -0.953,-0.635; 2 -0.953,0.635; 3 0.317,-0.635; 4 0.317,0.635; 5 1.588,-0.635; 6 1.588,0.635 | hole 2.451: -2.223,-2.54; -2.223,2.54; 0.952,-2.54; 0.952,2.54 | hole 1.067: -2.223,0; 2.857,-1.016; 2.857,1.016
KH-TYPE-C-16P_KINGHELM_KH-TYPE-C-16P = smd 0.6 x 1.15: A1_B12 -3.2,4.725; A4_B9 -2.4,4.725; A9_B4 2.4,4.725; A12_B1 3.2,4.725 | smd 0.3 x 1.15: A5 -1.25,4.725; A6 -0.25,4.725; A7 0.25,4.725; A8 1.25,4.725; B5 1.75,4.725; B6 0.75,4.725; B7 -0.75,4.725; B8 -1.75,4.725 | drill 0.65 pad 1.05: SH1 -4.32,0; SH2 4.32,0; SH3 -4.32,4.15; SH4 4.32,4.15 | hole 0.7: -2.89,3.65; 2.89,3.65
NORDIC_NRF_2_RESC0402_L = smd 0.5 x 0.6: 1 -0.5,0; 2 0.5,0
ESP32_C6_LIBRARY_2_IND_4828-WE-TPC_WRE = smd 0.9 x 5.3: 1 -2.286,0; 2 2.286,0
MLP2016SR47MT0S1_INDC2016X100N = smd 1.2 x 2.2: 1 -1.028,0; 2 1.028,0
ESP32_C6_LIBRARY_4_ESP32_C6_LIBRARY_4_ESP32_C6_LIBRARY_4_ESP32_C6_LIBRARY_4_ESP32_WROVER_SPARKFUN-DISCRETESEMI_SOT23-3 = smd 0.8 x 0.9: 1 -0.95,-1; 2 0.95,-1; 3 0,1.1
ESP32_C6_LIBRARY_6_SOT65P210X110-3N = smd 1.05 x 0.5: 1 -1.05,0.65; 2 -1.05,-0.65; 3 1.05,0
ERA-1AEB3401C_0201 = smd 0.35 x 0.25: 1 0,0.275; 2 0,-0.275
ESP32_C6_LIBRARY_7_JUMPER_SJ = smd 1.168 x 1.6: 1 -0.762,0; 2 0.762,0
2025-10-22_07-23-44_LIBRARY_SW_EVP-AKE31A_PAN = smd 0.711 x 1.092: 1 -1.4,-0.972; 2 1.4,-0.972 | drill 0.559 pad 0.914 square: 3 -1.848,0.381; 4 1.848,0.381 | smd 1.397 x 1.092: 5 0,-1.124
HECTOR_WATCH_1_TP20R = smd 2 x 2: TP 0,0
NORDIC_NRF_4_AQFN50P700X700X85_HS-74N = smd 4.85 x 4.85: P$74 0,0 | drill 0.3 pad 0.6: P$75 -1.8,1.8; P$76 -0.6,1.8; P$77 0.6,1.8; P$78 1.8,1.8; P$79 -1.8,0.6; P$80 -0.6,0.6; P$81 0.6,0.6; P$82 1.8,0.6; P$83 -1.8,-0.6; P$84 -0.6,-0.6; P$85 0.6,-0.6; P$86 1.8,-0.6; P$87 -1.8,-1.8; P$88 -0.6,-1.8; P$89 0.6,-1.8; P$90 1.8,-1.8 | smd 0.2 x 0.2: P$A8 -1.25,3.25; P$A10 -0.75,3.25; P$A12 -0.25,3.25; P$A14 0.25,3.25; P$A16 0.75,3.25; P$A18 1.25,3.25; P$A20 1.75,3.25; P$A22 2.25,3.25; P$A23 2.75,3.25; P$AA24 3.25,-2.25; P$AB2 -2.75,-2.5; P$AC5 -2,-2.75; P$AC9 -1,-2.75; P$AC11 -0.5,-2.75; P$AC13 0,-2.75; P$AC15 0.5,-2.75; P$AC17 1,-2.75; P$AC19 1.5,-2.75; P$AC21 2,-2.75; P$AC24 3.25,-2.75; P$AD2 -2.75,-3.25; P$AD4 -2.25,-3.25; P$AD6 -1.75,-3.25; P$AD8 -1.25,-3.25; P$AD10 -0.75,-3.25; P$AD12 -0.25,-3.25; P$AD14 0.25,-3.25; P$AD16 0.75,-3.25; P$AD18 1.25,-3.25; P$AD20 1.75,-3.25; P$AD22 2.25,-3.25; P$AD23 2.75,-3.25; P$B1 -3.25,2.75; P$B3 -2.5,2.75; P$B5 -2,2.75; P$B7 -1.5,2.75; P$B9 -1,2.75; P$B11 -0.5,2.75; P$B13 0,2.75; P$B15 0.5,2.75; P$B17 1,2.75; P$B19 1.5,2.75; P$B24 3.25,2.75; P$C1 -3.25,2.25; P$D2 -2.75,2; P$D23 2.75,2; P$E24 3.25,1.75; P$F2 -2.75,1.5; P$F23 2.75,1.5; P$G1 -3.25,1.25; P$H2 -2.75,1; P$H23 2.75,1; P$J1 -3.25,0.75; P$J24 3.25,0.75; P$K2 -2.75,0.5; P$L1 -3.25,0.25; P$L24 3.25,0.25; P$M2 -2.75,0; P$N1 -3.25,-0.25; P$N24 3.25,-0.25; P$P2 -2.75,-0.5; P$P23 2.75,-0.5; P$R1 -3.25,-0.75; P$R24 3.25,-0.75; P$T2 -2.75,-1; P$T23 2.75,-1; P$U1 -3.25,-1.25; P$U24 3.25,-1.25; P$V23 2.75,-1.5; P$W1 -3.25,-1.75; P$W24 3.25,-1.75; P$Y2 -2.75,-2; P$Y23 2.75,-2
ESP32_C6_LIBRARY_SON50P200X200X80-9N = smd 0.76 x 0.27: 1 -0.985,0.75; 2 -0.985,0.25; 3 -0.985,-0.25; 4 -0.985,-0.75; 5 0.985,-0.75; 6 0.985,-0.25; 7 0.985,0.25; 8 0.985,0.75 | smd 0.9 x 1.3: 9 0,0
NORDIC_NRF_BT-XTAL_2016_N = smd 0.95 x 0.85: 1 -0.725,-0.575; 2 0.725,-0.575; 3 0.725,0.575; 4 -0.725,0.575
NORDIC_NRF_1_XTAL_3215_N = smd 1 x 1.8: 1 -1.25,0; 2 1.25,0

### Placement (x,y rotation side)
ANT1  43.4,22.4 0 top
C1  35.4,24.6 0 top
C1-EP-DR  23.2,12.45 0 top
C2  37.6,24.4 0 top
C2-EP-DR  21.9,11.1 0 top
C3  42.4,18.55 0 top
C4  42.4,19.3 0 top
C5  26.4,21.2 180 top
C6  26.1,16 180 top
C7  30.1,13.2 180 top
C8  32.3,13.2 0 top
C9  34.5,13.7 180 top
C10  35.8,19.2 0 top
C11  36.95,19.8 0 top
C12  33.6,22.3 90 top
C13  32.8,22.3 90 top
C14  27.6,22.6 90 top
C15  30.9,22.6 90 top
C16  32,22.3 90 top
C17  26.4,20.2 0 top
C18  26.4,19.3 0 top
C19  5.8,27.05 270 top
C20  26.1,14.2 180 top
C21  27.7,13.2 270 top
C22  42.4,20 0 top
C23  7.1,32.1 90 top
C24  7.1,33.9 90 top
C25  7.1,30.6 90 top
C27  29.6,30 180 top
C29  33.5,5.2 180 top
C30  11.5,5.2 180 top
C31  22.6,5.2 180 top
C32  13.5,34 90 top
C33  12.5,31.7 90 top
C34  13.5,32.3 270 top
C37  17.6,25.1 0 top
C38  18,21.2 180 top
C39  15.2,23.9 270 top
C42  16.5,21.2 180 top
C43  15.2,21.7 270 top
D2  15.2,7.7 0 top
D3  34,27.4 270 top
D4  17.4,11.9 0 top
D5  9.5,7.7 0 top
EPD_C1  12.9,21.4 180 top
EPD_C2  12.9,22.3 180 top
EPD_C5  12.7,16.7 180 top
EPD_C6  13.1,15.9 180 top
EPD_C7  13.1,15 180 top
EPD_C8  13.1,14.1 180 top
EPD_C9  13.1,13.2 180 top
EPD_C10  13.1,12.3 180 top
EPD_C11  13.1,11.4 180 top
EPD_C12  13.1,10.5 180 top
IC1  17.5,23.2 90 top
IC2  15.7,33.1 0 top
IC3  2.9,27.5 0 top
IC9  9.8,33.1 270 top
J1  9.1,17.5 270 top
J2  40.3,9.7 90 top
J4  23,33.7 180 top
L1  41.05,19.05 90 top
L2  28.7,22.6 90 top
L3  29.8,22.6 90 top
L5  17.4,16.7 90 top
L7  9.8,30.1 180 top
Q1  38.8,29.8 0 top
Q3  22.4,14.7 0 top
R1_EP_DR  21.8,9.5 0 top
R1_USB  24,27.5 180 top
R2  12.4,34.3 0 top
R2_EP_DR  20.9,9.5 0 top
R2_USB  21.2,27.5 0 top
R3  5.5,25.6 0 top
R4  12.4,33.3 0 top
R5  10.6,5.3 180 top
R7  32.6,5.3 180 top
R8  21.6,5.3 180 top
R9  19.7,24.3 0 top
R17  10.1,26.1 90 top
R18  10.1,27.5 90 top
R_PWR_EPD  38.9,26.9 90 top
R_TYPE_SEL  22.8,9.5 0 top
SJ1  22.4,7.6 0 top
SW_DN  34,3 180 top
SW_ENT  23,3 180 top
SW_UP  12,3 180 top
TP1  14,29.1 0 top
TP2  16.4,29.1 0 top
TP_3.3V  30.5,10.6 0 top
TP_3V3  2.4,31.2 0 top
TP_BAT_GND  34.1,31 0 top
TP_GND  19.3,7.6 0 top
TP_RESET  28,10.6 0 top
TP_SCL  7.5,26.7 0 top
TP_SDA  12.2,26.7 0 top
TP_SWDCLK  33.3,10.6 0 top
TP_SWDIO  33.25,8.1 0 top
TP_SWO  30.65,8.1 0 top
TP_VBAT  30.7,28.4 0 top
TP_VREG  5,33.3 0 top
U1  30.8,17.9 0 top
U3  30.7,32.3 0 top
X1  36.8,21.5 0 top
X2  24.05,17.75 0 top

### Tracks (layer width: path | path; a pad name or v marks a point on that pad's centre or on a via)
3V3  (via drill 0.35 pad 0.5)
  Top 0.2: IC2.C2 15.7,32.2 15.55,32.05 13.81,32.05 13.75,32.12 C34.2 13.4,32.02 13.4,31.4 13.2,31.2 C33.1
  Top 0.305: U1.P$Y2 27.8,16.15 U1.P$W1 27.4,16 C6.1 26.5,15.9 26.5,15.2 v26.6,15.1 | C25.1 v7.1,29.3 6.2,28.4 6.2,27.7 C19.1 | C19.1 5.8,27.55 5.07,28.27 IC3.7 3.6,28.32 3.6,29.5 3.3,29.8 2.6,29.8 2.15,29.35 IC3.10 | C25.1 6.7,30.5 4.1,30.5 3.4,31.2 TP_3V3.TP | IC9.E2 IC9.E3 7.8,31.5 7.8,30.8 C25.1 | U1.P$AD14 31.05,13.89 C7.1 30.36,12.3 v30,11.95 30,11.1 TP_3.3V.TP 30.5,11.66 C8.1 32.05,13.54 32.3,13.8 33.1,13.8 33.55,14.25 U1.P$AD23 | J2.1 41.2,8.48 41.2,5.4 41.5,5.1 v41.5,3.45 | U1.P$A22 33.05,21.5 C12.1 34.34,22.05 v34.5,22.2 | U1.P$B1 27.6,20.7 C14.1 27.55,22.15 v26.3,22.15 | C33.1 12.3,31 12.3,30.6 v12,30.3 | R17.1 R18.1 9.68,27.65 9.25,27.65 v9.1,27.5 | IC3.3 3.15,26.25 3.4,26 4.5,26 5,26.5 5,27.1 5.2,27.3 C19.1 | R_PWR_EPD.2 39.75,27.48 Q1.2 39.95,29 40.9,29 v41.1,28.8
  Route15 0.305: v7.1,29.3 8.9,27.5 v9.1,27.5 9.2,27.5 v12,30.3 15.4,26.9 15.4,24.1 14.7,23.4 13.8,23.4 13,22.6 13,10.4 15.4,8 28.3,8 30,9.7 v30,11.95 | v30,11.95 33,11.95 35.95,9 35.95,6.35 36.9,5.4 39.55,5.4 v41.5,3.45 | v30,11.95 26.85,15.1 v26.6,15.1 26.3,15.4 v26.3,22.15 34.45,22.15 v34.5,22.2 v41.1,28.8
ALERT  (via drill 0.2)
  Top 0.15: U3.5 31.7,31.54 v31.7,30.55
  Bottom 0.15: U1.P$J24 34.45,19.05 34.45,20 34.1,20.35 33.8,20.35 33.1,21.05 33.1,22.5 36.95,26.35 36.95,27.35 36.2,28.1 34.15,28.1 v31.7,30.55
  other vias: 34.05,18.65
D+  (via drill 0.2)
  Top 0.15: U1.P$AD6 29.05,14.5 v28.6,14.05 | D3.4 v31.8,26.15 | v24.8,23.7 24.35,23.25 24.35,20.95 22.85,19.45 21.1,19.45 v21,19.35
  Bottom 0.15: v28.6,14.05 25.45,14.05 21,18.5 v21,19.35 | v31.8,26.15 26.55,26.15 24.8,24.4 v24.8,23.7
D-  (via drill 0.2)
  Top 0.15: v35.95,27.1 35,26.15 D3.6 | v21.45,18.9 21.6,19.05 22.9,19.05 24.7,20.85 24.7,22.95 v25.45,23.7
  Bottom 0.15: U1.P$AD4 28.4,14.5 25.4,14.5 21.45,18.45 v21.45,18.9 | v35.95,27.1 35.95,26.6 35,25.65 26.95,25.65 25.45,24.15 v25.45,23.7
  other vias: 28.55,14.65
DEC1
  Top 0.15: U1.P$C1 27.5,20.15 26.66,21 C5.1
DEC4_6  (via drill 0.2)
  Top 0.15: L3.2 30.8,22.1 | 30.8,22.1 C15.1 30.95,22.05 C16.1 31.61,21.65 v31.5,21.65 | C10.1 35.3,19.45 34.25,19.45 U1.P$E24 | U1.P$B5 28.8,21 29.3,21.5 30.4,21.5 30.8,21.9 30.8,22.1
  Bottom 0.15: v31.5,21.65 32.6,20.55 33.15,20.55 U1.P$E24
  other vias: 34.05,19.65
DN  (via drill 0.2)
  Top 0.15: J4.A7 22.75,28.15 23,27.9 23.5,27.9 23.75,28.15 J4.B7 v23.75,30.2 | D3.1 v36.15,28.65
  Bottom 0.15: v36.15,28.65 33.8,31 24.55,31 v23.75,30.2
DP  (via drill 0.2)
  Top 0.15: J4.A6 23.25,30.05 23.1,30.2 22.6,30.2 22.25,29.85 J4.B6 v22.25,27.9 | v32.25,28.65 D3.3
  Bottom 0.15: v22.25,27.9 23.2,26.95 30.55,26.95 v32.25,28.65
EPD_3V3  (via drill 0.35 pad 0.5)
  Top 0.305: J1.15 J1.16 11.3,15.75 11.85,16.3 12.04,16.3 EPD_C5.2 12.4,16.75 12.4,17 14.39,18.99 L5.2 20.15,18.99 20.5,18.64 v20.5,17.7 | C1-EP-DR.1 20.65,12.45 v20.5,12.6 | Q1.3 v37.2,30.9
  Route15 0.305: v20.5,12.6 v20.5,17.7 20.5,20.1 24.8,24.4 34.2,24.4 37.2,27.4 v37.2,30.9
EPD_BUSY  (via drill 0.2)
  Top 0.15: U1.P$AD12 v30.55,14.1 | J1.9 11.3,19.25 v11.4,19.35
  Top 0.152: v24.75,9.3 25.25,9.3 v26.05,8.5
  Bottom 0.152: v30.55,14.1 30.8,13.85 30.8,11.95 29.05,10.2 28.45,10.2 26.7,8.45 26.1,8.45 v26.05,8.5 | v24.75,9.3 24.7,9.3 22.15,11.85 22.15,15.5 21.6,16.05 19.4,16.05 17.75,14.4 10.5,14.4 9.05,15.85 9.05,18.4 10,19.35 v11.4,19.35
EPD_CS  (via drill 0.2)
  Top 0.15: v11.4,17.65 11.3,17.75 J1.12 | v21.8,22.45 21.8,21.2 20.4,19.8 14.4,19.8 v13.6,19
  Bottom 0.15: U1.P$K2 24,22.45 v21.8,22.45 | v13.6,19 12.25,17.65 v11.4,17.65
  other vias: 28.05,18.4
EPD_DC  (via drill 0.2)
  Top 0.15: U1.P$AD10 30.05,14.6 v29.05,13.6 | v11.4,18.25 J1.11
  Bottom 0.15: v29.05,13.6 25.65,10.2 24.7,10.2 22.8,12.1 22.8,15.7 21.85,16.65 19.2,16.65 17.55,15 10.7,15 9.65,16.05 9.65,18.1 10.05,18.5 11.15,18.5 v11.4,18.25
EPD_RST  (via drill 0.2)
  Top 0.15: J1.10 11.35,18.75 v11.4,18.8
  Top 0.152: v25.15,9.8 25.65,9.8 v26.5,8.95
  Bottom 0.15: U1.P$AC11 30.3,14.45 30.05,14.2 30.05,12.7 26.5,9.15 v26.5,8.95
  Bottom 0.152: v25.15,9.8 24.7,9.8 22.5,12 22.5,15.55 21.7,16.35 19.3,16.35 17.65,14.7 10.6,14.7 9.35,15.95 9.35,18.2 9.95,18.8 v11.4,18.8
  other vias: 30.3,15.15
GDR  (via drill 0.2)
  Top 0.15: R2_EP_DR.2 20.52,8.85 v20.25,8.85 | v19.65,13.5 20.1,13.5 20.5,13.9 20.5,14.45 21.35,15.3 Q3.1 | J1.2 11.05,22.75 11.35,23.05 11.35,23.65 11.65,23.95 v11.95,23.95
  Bottom 0.15: v20.25,8.85 19.5,9.6 19.5,13.35 v19.65,13.5 19.65,14.3 19.3,14.65 19.1,14.65 18.25,13.8 10.3,13.8 8.45,15.65 8.45,22.05 9.85,23.45 11.45,23.45 v11.95,23.95
GND  (via drill 0.35, 0.35 pad 0.25, 0.35 pad 0.5)
  Top 0.2: IC9.B1 10.1,33.6 9.9,33.6 IC9.C1 | C33.2 12.79,32.48 C34.1 13.6,32.59 13.6,33.05 13.4,33.25 13.4,33.72 C32.1 13.81,33.81 14.1,34.1 14.3,34.1 v14.4,34 | 29.79,31.54 C27.1 29.98,29.8 32.6,29.8 | C25.2 C23.1 6.8,31.91 6.6,32.12 6.6,32.9 C24.1 | C30.1 13.1,5.2 13.4,4.9 SW_UP.1 | SW_ENT.1 24.4,4.7 23.9,5.2 C31.1 | C29.1 35.1,5.2 35.4,4.9 SW_DN.1 | R9.1 19.7,25.7 19.3,26.1 17.83,26.1 17.41,25.69 C37.1 v16.5,25.1 | C43.2 C42.2 16.32,20.88 16.45,20.75 18.05,20.75 18.18,20.88 C38.1
  Top 0.305: IC9.C1 IC9.C2 IC9.C3 v9.8,30.9 | J2.3 J2.5 40.3,11.92 40.3,14.35 v38.9,15.75 | IC3.8 IC3.9 2.6,28.32 2.6,28.8 v2.9,29.1 | EPD_C10.1 14.2,12.3 14.6,11.9 D4.1 | EPD_C10.1 EPD_C11.1 EPD_C12.1 13.95,10.15 v14.45,10.15 | EPD_C10.1 EPD_C9.1 EPD_C8.1 EPD_C7.1 EPD_C6.1 13.6,16.05 EPD_C5.1 | J1.17 9.35,15.25 7.97,13.88 J1.MP2 7.97,9.97 6.8,8.8 v5.4,8.8 | EPD_C1.1 EPD_C2.1 13.4,22.8 14,23.4 C39.2 | EPD_C1.1 13.6,21.2 C43.2 | C19.2 5.8,26.43 5.5,26.12 R3.1 5.6,25.77 6.12,25.77 6.6,25.3 7.2,25.3 7.97,24.52 J1.MP1 | R2_USB.2 R1_USB.1 24.23,27.23 v24.7,27.7 | J4.A1_B12 26.75,28.98 J4.SH3 J4.SH1 | J4.SH4 19.25,28.98 J4.A12_B1 | J4.SH4 J4.SH2 17.9,33.7 17.3,33.1 IC2.B3 | U3.1 29.07,33.7 J4.SH1 | J4.SH1 27.92,34.3 33.25,34.3 33.75,33.8 33.75,32.6 33.2,32.05 U3.6 30.95,32.05 30.85,32.15 | U3.9 30.85,32.15 | U3.4 29.8,31.55 | 29.8,31.55 30.25,31.55 30.85,32.15 | 29.79,31.54 29.8,31.55 | 32.6,29.8 33.8,31 TP_BAT_GND.TP 34.35,30.75 34.35,29 D3.2 | R9.1 18.98,24.57 18.1,23.7 IC1.D2 | C9.2 33.84,13.3 32.66,13.3 C8.2 v32.55,12.6 | C7.2 29.34,12.7 C21.2 27.2,12.2 25.8,12.2 25.6,12.4 v25.6,12.75 | C25.2 4.7,31.1 3.7,32.1 v3.7,32.4 | J4.SH4 17.75,28.62 v17.75,27.55 | EPD_C1.1 13.4,20.95 13,20.55 11.85,20.55 11.05,19.75 J1.8 9.55,19.75 7.97,21.32 J1.MP1 | C6.2 C20.2 25.6,13.9 25.2,13.5 24.5,13.5 23.7,12.7 C1-EP-DR.2 24.2,11.95 24.2,10.2 23.65,9.65 22.93,9.65 R_TYPE_SEL.1 22.8,10.1 22.5,10.4 21.1,10.4 20.9,10.2 R2_EP_DR.1 20.77,9.65 18.8,9.65 v18.65,9.5 18.65,9.25 19.3,8.6 TP_GND.TP SJ1.1 | C18.1 C17.1 26.09,20.25 25.85,20.25 v25.5,19.9 | C5.2 25.7,21.64 25.7,22.5 26.3,23.1 C14.2 27.55,23.15 27.55,23.65 28.05,24.15 30.45,24.15 30.9,23.7 C15.2 31.05,22.95 31.61,22.95 C16.2 C13.2 C12.2 34.34,23.3 v34.55,23.3
  Top 0.305: SW_UP.1 14.87,3.97 v14.9,4 | SW_ENT.1 25.87,3.97 v25.9,4 | SW_DN.1 35.43,4 v36.85,4 | v38.4,24.4 38.3,24.3 37.95,24.3 C2.2 37.86,25.09 37.6,25.35 36.41,25.35 C1.2 36.08,24.18 X1.4 36.52,22.07 36.7,21.9 36.7,21.6 37.38,20.93 X1.2 37.52,20.12 C11.2 37.3,19.9 v38,19.9 38,19.75 37.5,19.25 36.11,19.25 C10.2 | J1.MP1 v9.29,24.04 v9.3,24.05 | U1.P$B7 29.3,20 U1.P$75 | U1.P$F23 32.9,19.4 U1.P$78 | U1.P$84 U1.P$74 | C22.2 C4.2 C3.2 43.4,17.8 v43.4,17.55 | IC2.B1 14.65,33.1 14.4,33.35 v14.4,34
  other vias: 38,17.55 39.8,17.55 41.6,17.55 43.4,19.6 45.2,19.6 39.8,25.3 41.6,25.3 43.4,25.3 45.2,25.3 39.55,23.5 39.55,21.7 36.2,17.55 39.55,19.9
  pour Route2: 41.16,24.26 41.18,24.28 46.07,24.28 52,30.21 45.28,36.92 -2.27,36.92 -3.35,35.94 -5.42,33.87 -5.42,-0.57 -2.67,-3.32 19.18,-3.32 19.19,-3.32 19.2,-3.32 19.22,-3.32 19.22,-3.32 46.27,-3.42 46.32,-3.37 46.32,-3.33 46.29,-3.29 46.27,-3.27 46.27,19.87 45.69,20.46 45.67,20.48 45.67,20.52 45.67,20.52 44.78,20.52 44.64,20.39 44.62,20.37 43.83,20.37 43.69,20.24 43.67,20.22 43.28,20.22 43.03,19.97 43.03,19.33 43.46,18.89 43.48,18.87 43.48,18.33 43.46,18.31 43.09,17.94 43.07,17.92 42.83,17.92 42.69,17.79 42.67,17.77 42.18,17.77 42.16,17.79 41.87,18.07 35.88,18.07 35.78,17.97 35.78,17.93 35.76,17.91 35.69,17.84 35.67,17.82 34.98,17.82 34.96,17.84 34.72,18.07 34.63,18.07 34.61,18.09 34.42,18.27 33.53,18.27 33.51,18.29 33.09,18.71 33.07,18.73 33.07,18.87 33.09,18.89 33.56,19.36 33.58,19.38 33.72,19.38 33.74,19.36 33.78,19.33 34.72,19.33 34.74,19.31 35.15,18.91 35.16,18.91 35.18,18.93 39.42,18.93 40.47,19.98 40.47,23.57 40.49,23.59
HAPTIC_EN  (via drill 0.2)
  Top 0.15: U1.P$U1 27.1,16.65 v26.9,16.85 | v13.7,27.1 13.7,27.45 12.85,28.3 v12.15,28.3 | v19.8,22.45 v19.8,21.05
  Bottom 0.15: IC2.A1 15.85,33.6 16.15,33.3 16.15,32.6 12.15,28.6 v12.15,28.3 | v26.9,16.85 24.55,16.85 20.35,21.05 v19.8,21.05 | v13.7,27.1 18.35,22.45 v19.8,22.45
  other vias: 15.2,33.6
IMU_INT1  (via drill 0.2, 0.25 pad 0.25)
  Top 0.15: U1.P$N1 27,17.65 v26.9,17.55 | IC3.5 3.95,27.25 v4.4,26.8 | v22.2,23.8 22.2,20.85 v21.7,20.35
  Bottom 0.15: v4.4,26.8 4.65,26.55 9.65,26.55 10.1,27 10.7,27 10.8,26.9 13,26.9 13.35,27.25 13.35,27.45 13.5,27.6 14.2,27.6 15.6,26.2 20,26.2 22.2,24 v22.2,23.8 | v26.9,17.55 24.5,17.55 v21.7,20.35
IMU_INT2  (via drill 0.2, 0.25 pad 0.25)
  Top 0.15: IC3.6 4.25,27.75 v4.4,27.6 | v22.8,23.8 22.8,20.8 v22.35,20.35
  Bottom 0.15: v4.4,27.6 5,27 9.55,27 9.9,27.35 12.75,27.35 13.35,27.95 15.5,27.95 16.85,26.6 20.05,26.6 22.8,23.85 v22.8,23.8 | U1.P$P2 28.02,17.38 27.45,17.95 24.75,17.95 v22.35,20.35
  other vias: 28.05,17.4
LX1
  Top 0.15: IC9.B2 IC9.B3 10.2,32.3 10.8,31.7 10.8,30.13 L7.1
LX2
  Top 0.15: IC9.D2 IC9.D3 9.4,32.3 8.77,31.67 L7.2
MOSI  (via drill 0.2)
  Top 0.15: J1.14 11.6,16.75 12.4,17.55 12.4,18.55 13.95,20.1 19.95,20.1 21.15,21.3 v21.15,22.45
  Bottom 0.15: U1.P$B13 26.6,20.65 24.15,23.1 21.8,23.1 v21.15,22.45
  other vias: 30.8,20.65
N$1
  Top 0.15: D5.2 11.25,8.95 11.7,9.4 14.8,9.4 17,11.6 17,14.01 L5.1 17.75,14.41 19.06,13.1 21.55,13.1 22.55,14.1 22.55,14.45 22.8,14.7 Q3.3 23.95,14.7 24.2,14.45 24.2,14.1 23.2,13.1 23.2,11.65 22.65,11.1 C2-EP-DR.2
N$2
  Top 0.15: L2.2 29.7,22.1 L3.1
N$3
  Top 0.15: IC1.D1 19.3,23 19.7,23.4 R9.2
N$4
  Top 0.15: U1.P$B24 35.8,20.65 X1.1 35.77,20.93 35.1,21.6 35.1,24.55 C1.1
N$5
  Top 0.15: U1.P$B3 28.3,21 28.7,21.4 L2.1
N$6
  Top 0.15: D2.1 13.55,7.8 14.5,7.8 17.6,10.9 18.6,10.9 19.15,11.45 D4.2 20.6,11.9 C2-EP-DR.1
N$7
  Top 0.15: R5.2 10.6,5.85 10.9,6.15 12.15,6.15 12.72,5.57 R8.2 21.6,5.9 22,6.3 22.9,6.3 23.62,5.57 R7.2
N$8
  Top 0.15: C32.2 13.81,34.5 15.4,34.5 15.7,34.2 IC2.A2
N$9
  Top 0.15: SJ1.2 23.16,8.86 R_TYPE_SEL.2 22.48,9.22 21.93,9.78 R1_EP_DR.1
N$10
  Top 0.15: J4.A5 24.25,28.02 R1_USB.2
N$11
  Top 0.15: J1.4 11.25,21.75 11.8,22.3 EPD_C2.2
N$12
  Top 0.15: J1.5 11.35,21.25 11.6,21.5 12.3,21.5 EPD_C1.2
N$14
  Top 0.2: U1.P$N24 34.4,17.3 34.4,16.6 35.3,15.7 35.3,14.25 C9.1
N$15
  Top 0.15: U1.P$A18 32.05,21.3 C13.1
N$17
  Top 0.15: U1.P$AC5 28.35,15.15 28.25,15.05 27.85,15.05 27,14.2 C20.1
N$18
  Top 0.15: R4.2 11.78,33.02 10.7,34.1 9.5,34.1 9.4,34 IC9.D1
N$19
  Top 0.15: J4.B5 21.25,27.82 R2_USB.1
N$20
  Top 0.152: C3.1 L1.1 40.85,18.35 35.2,18.35 34.45,19.1 33.75,19.1 U1.P$H23
N$21
  Top 0.15: IC9.E1 9,34.2 9.2,34.4 10.9,34.4 11.3,34 12.38,34 R2.2
N$24
  Top 0.15: U1.P$D23 33.85,20.2 34.5,20.2 34.7,20 36.49,20 C11.1
N$25
  Top 0.15: R3.2 2.48,25.32 2.1,25.7 2.1,26.68 IC3.1
N$26
  Top 0.15: EPD_C6.2 12,15.9 11.8,15.7 11.8,15.3 11.25,14.75 J1.18
N$27
  Top 0.15: EPD_C7.2 12.1,15 11.35,14.25 J1.19
N$28  (via drill 0.2)
  Top 0.15: v38.35,22.05 37.55,22.05 X1.3
  Top 0.2: C2.1 37.34,22.25 X1.3
  Bottom 0.15: U1.P$A23 37.45,21.15 v38.35,22.05
  other vias: 33.55,21.15
N$29
  Top 0.15: J1.20 11.45,13.75 11.8,14.1 EPD_C8.2
N$31
  Top 0.15: J1.22 11.35,12.75 11.8,12.3 EPD_C10.2
N$33
  Top 0.15: J1.24 11.15,11.75 11.4,11.5 11.4,10.8 11.7,10.5 EPD_C12.2
OUT+  (via drill 0.2)
  Top 0.15: IC2.A3 16.2,33.75 v16.5,34.05 | v14.65,30.45 14.65,29.75 TP1.TP
  Bottom 0.15: v16.5,34.05 16.5,32.3 v14.65,30.45
OUT-
  Top 0.15: IC2.C3 16.4,32.4 TP2.TP
P0.00
  Top 0.15: U1.P$D2 27.95,19.8 27,19.8 26.66,20.14 C17.2 26.66,20.34 26.3,20.7 25.6,20.7 24.9,20 24.9,19.85 X2.1
P0.01
  Top 0.15: U1.P$F2 27.95,19.5 26.86,19.5 C18.2 26.66,19.11 X2.2
P0.13  (via drill 0.2)
  Top 0.15: SW_UP.2 R5.1 10.78,5.2 C30.2 11.3,5.21 v11.3,5.7 | SW_UP.2
  Bottom 0.15: U1.P$AD8 29.45,14.55 29.45,12.95 23,6.5 22,6.5 21.2,5.7 v11.3,5.7
  other vias: 29.55,14.65
P0.14  (via drill 0.2)
  Top 0.15: SW_ENT.2 R8.1 21.7,5.12 22.34,5.12 C31.2 22.4,5.21 v22.4,5.8 | SW_ENT.2
  Bottom 0.15: U1.P$AC9 29.8,14.95 29.95,14.8 29.95,14.5 29.75,14.3 29.75,12.85 22.7,5.8 v22.4,5.8
  other vias: 29.8,15.15
P1.01  (via drill 0.2)
  Top 0.15: Q1.1 37.85,28.35 38.65,27.55 38.65,26.93 R_PWR_EPD.1 v38.05,26.9
  Bottom 0.15: U1.P$Y23 33.55,17.05 34.75,18.25 34.75,19.4 36.05,20.7 37.95,20.7 38.9,21.65 38.9,26.05 v38.05,26.9
  other vias: 33.55,15.9
P1.02  (via drill 0.2)
  Top 0.15: SW_DN.2 R7.1 32.67,5.1 33.22,5.1 C29.2 33.31,5.88 v33.3,5.9 | SW_DN.2 | U1.P$W24 34.35,15.85 v34.55,15.85
  Bottom 0.15: v34.55,15.85 35.05,15.85 35.8,15.1 35.8,8.4 v33.3,5.9
PMIC_INT  (via drill 0.2)
  Top 0.15: IC1.A1 16.9,21.8 v16.95,21.75
  Bottom 0.15: v16.95,21.75 18.7,20 20.95,20 24.55,16.4 27.55,16.4 U1.P$T2
  other vias: 28.05,16.9
PREVGH
  Top 0.15: EPD_C9.2 12.55,13.25 J1.21 10.57,13.2 10,13.2 9.8,13 9.8,9.75 D5.1
PREVGL
  Top 0.15: J1.23 11.15,12.25 12,11.4 EPD_C11.2 12.9,11.4 13.1,11.2 13.1,10.1 12.8,9.8 11.4,9.8 10.3,8.7 10.3,7 10.8,6.5 15.8,6.5 16.95,7.65 D2.2
RESE  (via drill 0.2)
  Top 0.15: R1_EP_DR.2 21.43,8.85 v21.3,8.85 | v21.55,14.7 21.55,14.25 Q3.2 | J1.3 11.1,22.25 v11.95,23.1
  Bottom 0.15: v21.3,8.85 21.3,9.7 19.95,11.05 19.95,12.9 21.55,14.5 v21.55,14.7 21.55,15.45 21.25,15.75 21.05,15.75 20.85,15.55 20.85,15.25 20.65,15.05 18.8,15.05 17.85,14.1 10.4,14.1 8.75,15.75 8.75,21.35 10,22.6 11.45,22.6 v11.95,23.1
RESET  (via drill 0.2)
  Top 0.15: TP_RESET.TP 28.05,10.55 v28.05,9.05 | J2.6 39.31,11.29 38.25,12.35 38.25,13.95 37.9,14.3 v37.15,14.3
  Bottom 0.15: v37.15,14.3 37.15,13.1 36.1,12.05 36.1,7 34.45,5.35 31.75,5.35 v28.05,9.05 28.05,9.35 28.25,9.55 29.6,9.55 31.65,11.6 31.65,14.3 U1.P$AC13
  other vias: 30.8,15.15
RF
  Top 0.152: L1.2 41.4,19.2 42.05,19.2 C4.1 C22.1 41.9,20.25 ANT1.1
SCK  (via drill 0.2)
  Top 0.15: J1.13 11.7,17.25 12.1,17.65 12.1,18.7 13.8,20.4 19.8,20.4 20.5,21.1 v20.5,22.45
  Bottom 0.152: U1.P$A12 26.65,21.15 24.4,23.4 21.45,23.4 v20.5,22.45
  other vias: 30.55,21.15
SCL  (via drill 0.2)
  Top 0.15: U3.7 32.6,32.55 v32.8,32.75 | R4.1 12.62,33.58 v12.95,33.25 | IC2.C1 15.15,32.55 v14.35,32.55 | IC3.12 2.7,27.25 v2.9,27.45 | v10.4,26.6 10.4,26.12 R17.2 10.38,25.98 9.85,25.45 8.75,25.45 TP_SCL.TP | IC1.B1 17.3,22.5 v17.9,21.9
  Bottom 0.15: v32.8,32.75 31.8,31.75 16.5,31.75 12.45,27.7 10.4,27.7 10,28.1 10,28.85 10.9,29.75 12.2,29.75 14.35,31.9 v14.35,32.55 13.65,32.55 v12.95,33.25 12.4,33.25 12.15,33 12.15,32.4 12.4,32.15 12.4,31.55 11.75,30.9 10.65,30.9 8.55,28.8 4.25,28.8 v2.9,27.45 4.65,25.7 9.5,25.7 v10.4,26.6 13.2,26.6 v17.9,21.9 21.95,21.9 25.1,18.75 26.55,18.75 26.65,18.85 27,18.85 27.95,17.9 U1.P$M2
  other vias: 28.05,17.9
SDA  (via drill 0.2, 0.25)
  Top 0.15: IC3.2 v2.65,26 | R2.1 12.72,34.58 v13,34.3 | U3.8 32.19,33.55 v32.8,33.55 | TP_SDA.TP 11.5,27.4 10.47,27.4 R18.2 10.38,27.75 10.78,28.15 v11.15,28.15 | U1.P$L1 27.1,18.15 v26.9,18.35 | IC1.C1 17.7,22.85 18.85,21.7 v18.85,20.9
  Bottom 0.15: v13,34.3 12.35,34.3 7.9,29.85 2.75,29.85 1.1,28.2 1.1,27.1 2.2,26 v2.65,26 3.5,25.15 14.1,25.15 17.75,21.5 18.25,21.5 v18.85,20.9 19.1,20.9 19.3,21.1 19.3,21.35 19.5,21.55 21.8,21.55 25,18.35 v26.9,18.35 | v13,34.3 14.2,33.1 IC2.B2 15.7,32.7 v11.15,28.15 | v13,34.3 13.8,34.3 14.05,34.55 16.8,34.55 17.05,34.3 17.05,33.2 17.95,32.3 27.9,32.3 28.5,32.9 28.5,33.35 29.15,34 32.35,34 v32.8,33.55
  other vias: 15.7,33.1
SWDCLK  (via drill 0.2)
  Top 0.15: U1.P$AA24 34.5,15.2 v34.9,15.2 | J2.4 38.7,9.05 36,9.05 34.45,10.6 TP_SWDCLK.TP 34.25,11.55 v35,11.55
  Bottom 0.15: v34.9,15.2 35,15.1 v35,11.55
SWDIO  (via drill 0.2)
  Top 0.15: U1.P$AC24 34.05,15.05 v34.55,14.55 | J2.2 39.66,8.16 39.3,7.8 39.3,6 38.5,5.2 35.7,5.2 33.25,7.65 TP_SWDIO.TP 34.25,9.1 v35,9.1
  Bottom 0.15: v34.55,14.55 34.55,9.55 v35,9.1
SWO  (via drill 0.2)
  Top 0.15: TP_SWO.TP 31.65,9.1 v31.7,9.1
  Bottom 0.15: v31.7,9.1 33.45,10.85 33.45,14.25 U1.P$AD22
  other vias: 33.05,14.65
VBAT  (via drill 0.35 pad 0.5)
  Top 0.2: IC1.C2 17.7,24.3 17.79,24.38 C37.2 18.09,25.4 v18.6,25.4 | 28.7,30.1 29.32,30.1 C27.2 29.4,29.98 29.4,29.8 30.7,28.5 TP_VBAT.TP 30.6,28.4
  Top 0.305: U3.2 U3.3 29.05,32.05 28.5,31.5 28.5,30.3 28.7,30.1 | v29.1,28.4 29.55,27.95 30.15,27.95 30.6,28.4
  Route15 0.305: v18.6,25.4 19.6,26.4 27.1,26.4 v29.1,28.4
VBUS  (via drill 0.35, 0.35 pad 0.5)
  Top 0.2: C38.2 C42.1 16.68,21.41 15.9,22.2 C43.1 15.2,22.5 15.5,22.8 15.8,22.8 16.4,23.4 IC1.A2
  Top 0.305: C43.1 v14.3,22.2 | U1.P$AD2 28.05,14.05 C21.1 27.2,13.2 v26.6,13.2 | v20.2,24.9 20.2,27.9 20.6,28.3 J4.A9_B4 20.6,29.5 21.85,30.75 24.15,30.75 25.4,29.5 J4.A4_B9 | D3.5 34,25.4 33.6,25 31.9,25 v31.8,25.1
  Route15 0.305: v26.6,13.2 26.6,12.1 25.1,10.6 15.1,10.6 14.3,11.4 v14.3,22.2 16.4,22.2 19.1,24.9 v20.2,24.9 24.1,24.9 24.3,25.1 v31.8,25.1
VREG  (via drill 0.35 pad 0.5)
  Top 0.203: C23.2 7.44,32.28
  Top 0.305: IC9.A1 IC9.A2 IC9.A3 11.4,31.9 v11.5,31.9 | v14.05,24.4 C39.1 16.8,24.4 17.3,23.9 IC1.B2 | v5,31.7 TP_VREG.TP 6.1,34.4 C24.2 7.65,34.4 8,34.05 8,32.85 7.44,32.28
  Route15 0.305: v11.5,31.9 11.3,31.7 v5,31.7 5.1,31.6 5.1,27.8 6.9,26 12.1,26 13.7,24.4 v14.05,24.4
(copper drawn outside any net)
  shapes: Bottom area x1